# EAGLE schematic BEP32_6stencil_Seed_wMilling (EAGLE 6.4), part 1 of 4

## Sheet 1 of 12
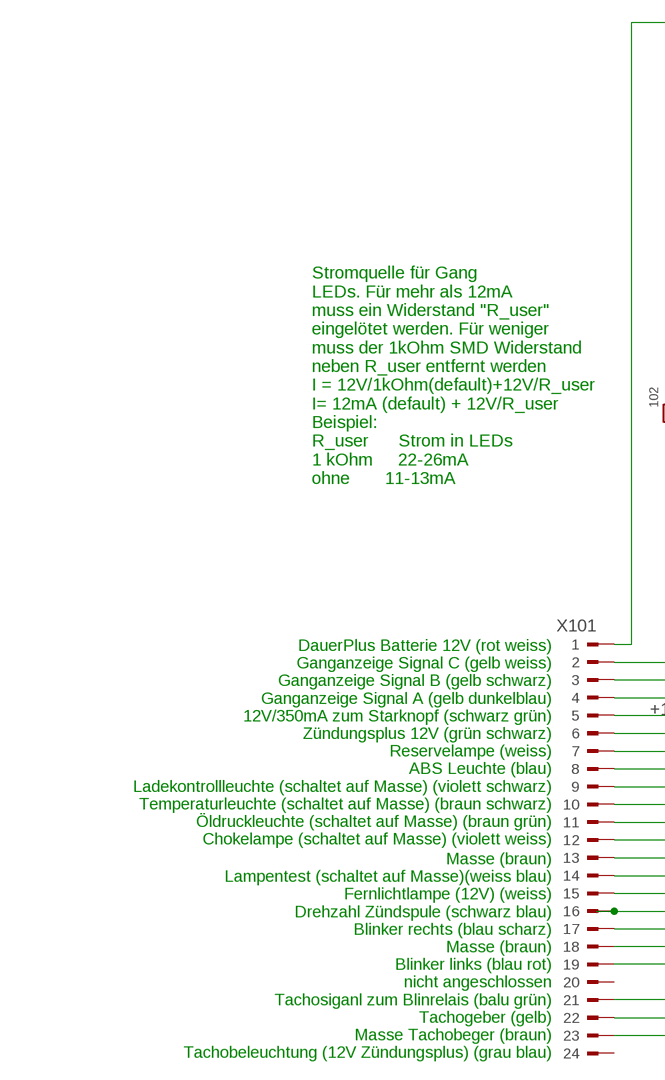
[diagram p0: schematic, sheet 1, part 1 of 2]
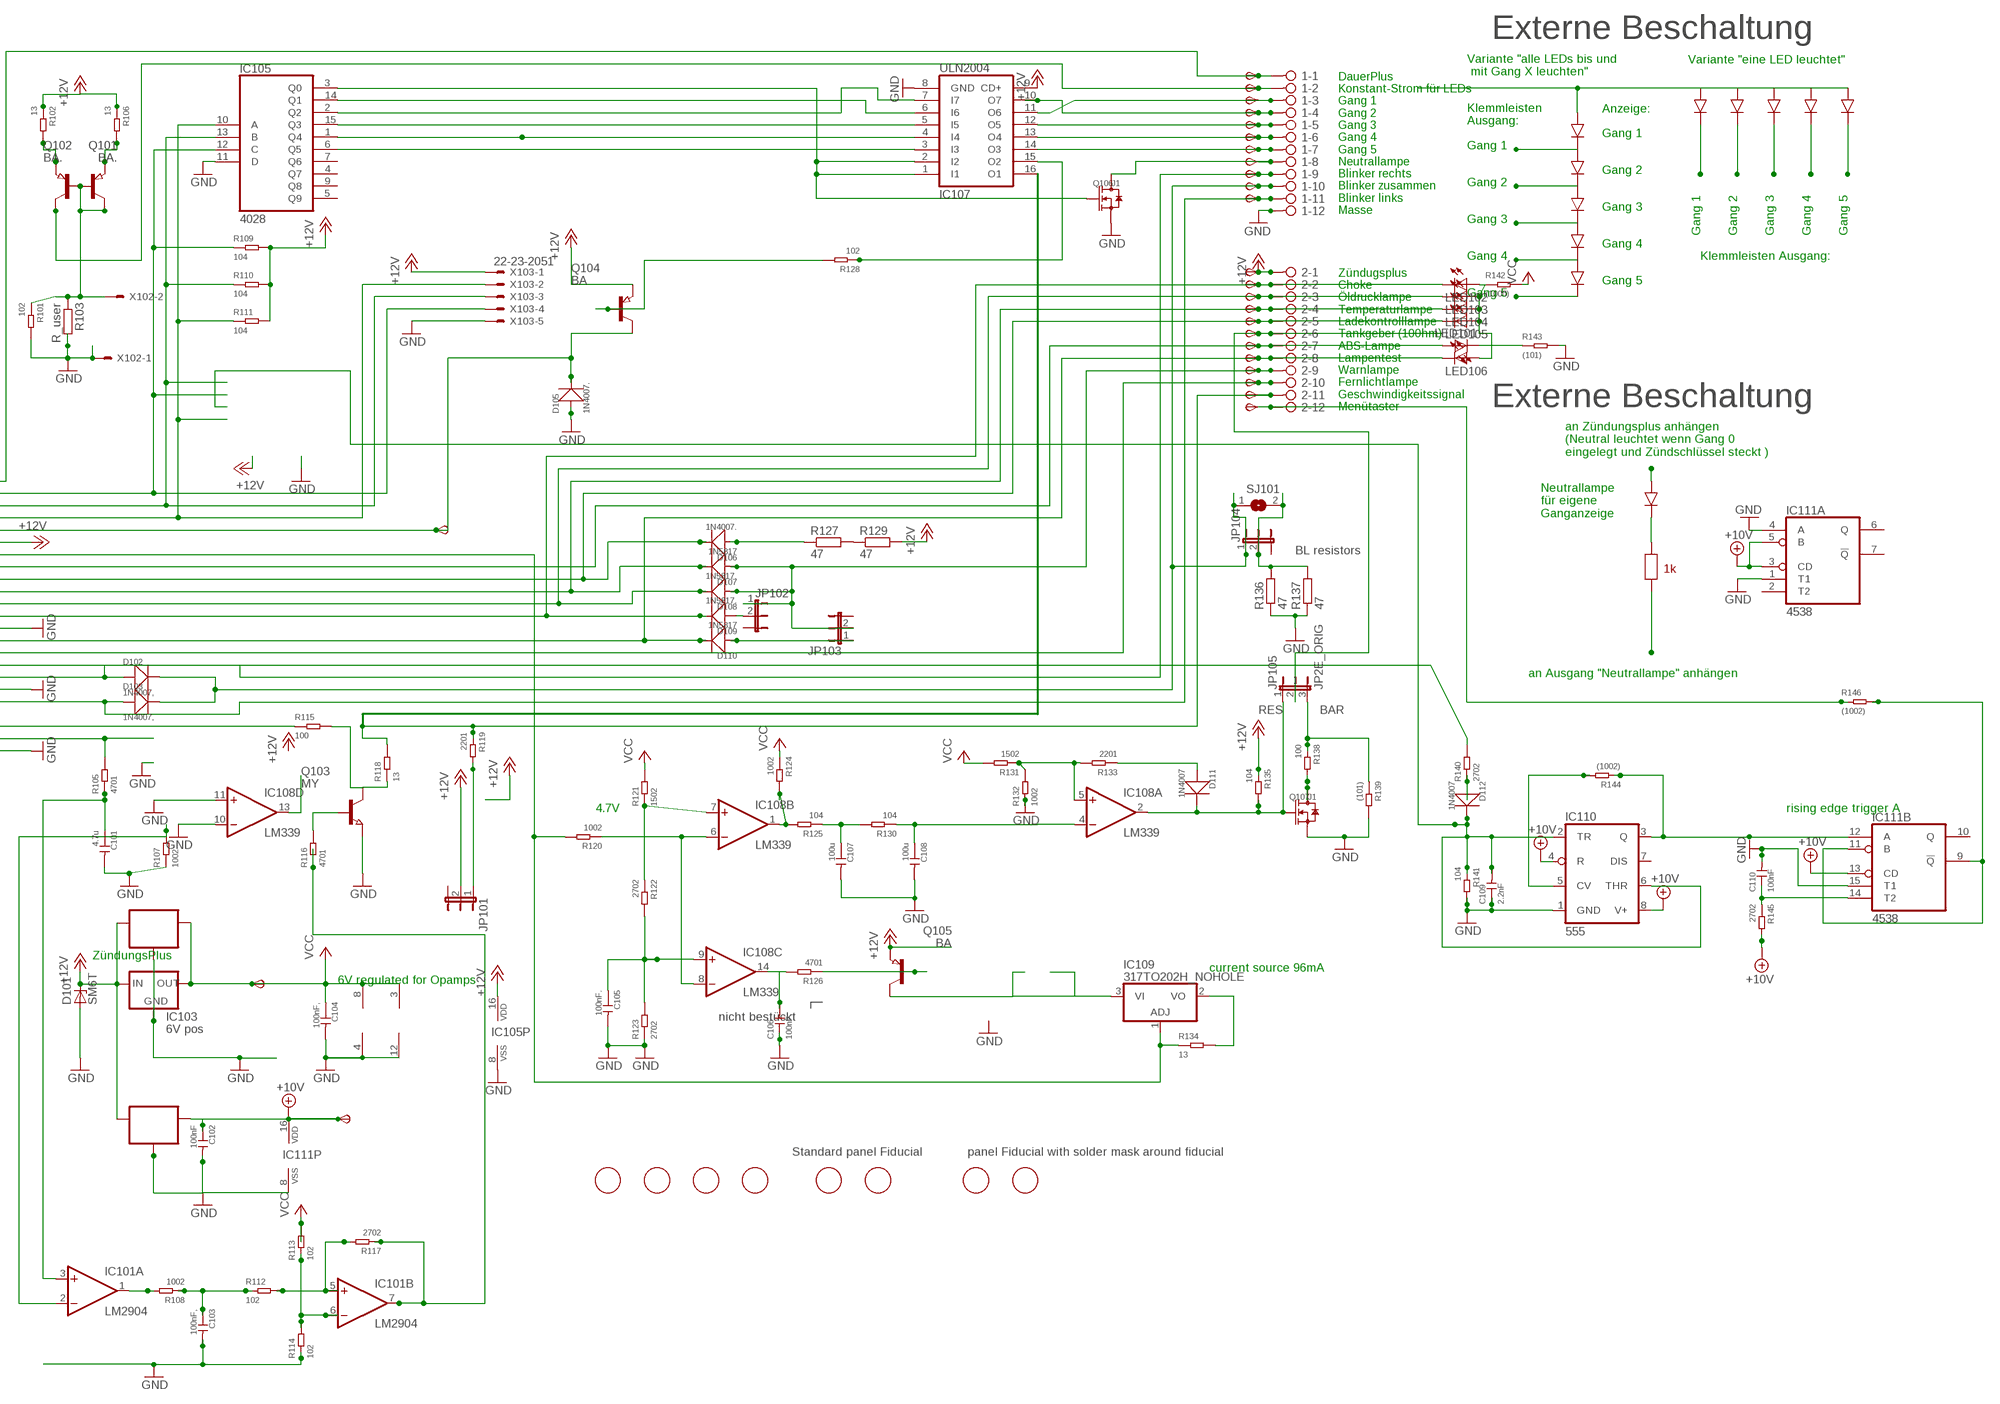
[diagram p1: schematic, sheet 1, part 2 of 2]

### Parts
1  2081-1132  [12-PIN]
2  2081-1132  [12-PIN]
6V  TPSB2.0  [B2.0]
10V  TPSB2.0  [B2.0]
C101  4.7u  CERAMIC-4.7UF-25V-10%-X5R(0805)  [C0805]
C102  100nF  CERAMIC-100NF-50V-10%-X7R(0805)  [C0805]
C103  100nF,  CERAMIC-100NF-50V-10%-X7R(0805)  [C0805]
C104  100nF,  CERAMIC-100NF-50V-10%-X7R(0805)  [C0805]
C105  100nF.  CERAMIC-100NF-50V-10%-X7R(0805)  [C0805]
C106  100nF.  CERAMIC-100NF-50V-10%-X7R(0805)  [C0805]
C107  100u  CERAMIC-100UF-6.3V-20%-X5R(1206)  [C1206]
C108  100u  CERAMIC-100UF-6.3V-20%-X5R(1206)  [C1206]
C109  2.2nF  CERAMIC-100NF-50V-10%-X7R(0805)  [C0805]
C110  100nF  CERAMIC-100NF-50V-10%-X7R(0805)  [C0805]
D101  SM6T  [DO214AA]
D102  1N4007,  DIODE-GEN-PURPOSE-1KV-1A(DO-214AC)  [DO-214AC]
D103  1N4007,  DIODE-GEN-PURPOSE-1KV-1A(DO-214AC)  [DO-214AC]
D105  1N4007.  DIODE-GEN-PURPOSE-1KV-1A(DO-214AC)  [DO-214AC]
D106  1N4007.  DIODE-GEN-PURPOSE-1KV-1A(DO-214AC)  [DO-214AC]
D107  1N5817  DIODE-GEN-PURPOSE-1KV-1A(DO-214AC)DO-214AC/1206  [DO-214AC_SLIM]
D108  1N5817.  DIODE-GEN-PURPOSE-1KV-1A(DO-214AC)DO-214AC/1206  [DO-214AC_SLIM]
D109  1N5817.  DIODE-GEN-PURPOSE-1KV-1A(DO-214AC)DO-214AC/1206  [DO-214AC_SLIM]
D110  1N5817  DIODE-GEN-PURPOSE-1KV-1A(DO-214AC)DO-214AC/1206  [DO-214AC_SLIM]
D111  1N4007  DIODE-GEN-PURPOSE-1KV-1A(DO-214AC)  [DO-214AC]
D112  1N4007  DIODE-GEN-PURPOSE-1KV-1A(DO-214AC)  [DO-214AC]
FID1  FIDUCIAL  [FIDUCIAL_1MM]
FID1B  FIDUCIALFIDUCIAL_1MM_WITH_SOLDERMASK  [FIDUCIAL_1MM_WITH_SOLDERMASK]
FID2  FIDUCIAL  [FIDUCIAL_1MM]
FID2B  FIDUCIALFIDUCIAL_1MM_WITH_SOLDERMASK  [FIDUCIAL_1MM_WITH_SOLDERMASK]
FID101  FIDUCIAL  [FIDUCIAL_1MM]
FID102  FIDUCIAL  [FIDUCIAL_1MM]
FID103  FIDUCIAL  [FIDUCIAL_1MM]
FID104  FIDUCIAL  [FIDUCIAL_1MM]
IC101  LM2904  LM358D  [SO08]
IC102  78L06  78LXXSOT89_ROUND  [SOT89_ROUND]
IC103  6V pos  78LXX  [78LXX]
IC104  78L10  78LXXSOT89_ROUND  [SOT89_ROUND]
IC105  4028  4028D  [SO16]
IC107  ULN2004  ULN2004AD  [SO16]
IC108  LM339  LM339D  [SO14]
IC109  317TO202H_NOHOLE  [TO220H_NOHOLE]
IC110  555  NE555D  [SO08]
IC111  4538  4538D  [SO16]
JP101  JP2EJP2_SMALLPADS  [JP2_SMALLPADS]
JP102  JP2EJP2_SMALLPADS  [JP2_SMALLPADS]
JP103  JP2EJP2_SMALLPADS  [JP2_SMALLPADS]
JP104  JP2EJP2_SMALLPADS  [JP2_SMALLPADS]
JP105  JP2E_ORIG  [JP2_ORIG_SMALLPADS]
LED101  LEDLD260  [LD260]
LED102  LEDLD260  [LD260]
LED103  LEDLD260  [LD260]
LED104  LEDLD260  [LD260]
LED105  LEDLD260  [LD260]
LED106  LEDLD260  [LD260]
Q101  BA.  PNP-TRANSISTOR_SOT89  [SOT89]
Q102  BA.  PNP-TRANSISTOR_SOT89  [SOT89]
Q103  MY  NPN-TRANSISTOR_SOT89  [SOT89]
Q104  BA  PNP-TRANSISTOR_SOT89  [SOT89]
Q105  BA  PNP-TRANSISTOR_SOT89  [SOT89]
Q106  J1  SMD-MOSFET-N-CH-50V-200MA-BSS138W-7-F(SOT-23)  [SOT-23]
Q107  J1  SMD-MOSFET-N-CH-50V-200MA-BSS138W-7-F(SOT-23)  [SOT-23]
R101  102  SMD-RES-1K-5%-1/8W(0805)  [R0805]
R102  13  SMD-RES-13R-5%-1/4W(1206)  [R1206]
R103  R_user  R-EU_R0805  [R0805]
R105  4701  SMD-RES-4.7K-5%-1/8W(0805)  [R0805]
R106  13  SMD-RES-13R-5%-1/4W(1206)  [R1206]
R107  1002  SMD-RES-10K-1%-1/8W(0805)  [R0805]
R108  1002  SMD-RES-10K-1%-1/8W(0805)  [R0805]
R109  104  SMD-RES-10K-1%-1/8W(0805)  [R0805]
R110  104  SMD-RES-10K-1%-1/8W(0805)  [R0805]
R111  104  SMD-RES-10K-1%-1/8W(0805)  [R0805]
R112  102  SMD-RES-1K-5%-1/8W(0805)  [R0805]
R113  102  SMD-RES-1K-5%-1/8W(0805)  [R0805]
R114  102  SMD-RES-1K-5%-1/8W(0805)  [R0805]
R115  100  SMD-RES-220R-5%-1/8W(0805)  [R0805]
R116  4701  SMD-RES-4.7K-5%-1/8W(0805)  [R0805]
R117  2702  SMD-RES-4.7K-5%-1/8W(0805)  [R0805]
R118  13  SMD-RES-13R-5%-1/4W(1206)  [R1206]
R119  2201  SMD-RES-2.2K-5%-1/8W(0805)  [R0805]
R120  1002  SMD-RES-10K-1%-1/8W(0805)  [R0805]
R121  1502  SMD-RES-10K-1%-1/8W(0805)  [R0805]
R122  2702  SMD-RES-4.7K-5%-1/8W(0805)  [R0805]
R123  2702  SMD-RES-4.7K-5%-1/8W(0805)  [R0805]
R124  1002  SMD-RES-10K-1%-1/8W(0805)  [R0805]
R125  104  SMD-RES-10K-1%-1/8W(0805)  [R0805]
R126  4701  SMD-RES-4.7K-5%-1/8W(0805)  [R0805]
R127  47  R-EU_V235/17_1MM  [V235/17_1MM]
R128  102  SMD-RES-1K-5%-1/8W(0805)  [R0805]
R129  47  R-EU_V235/17_1MM  [V235/17_1MM]
R130  104  SMD-RES-10K-1%-1/8W(0805)  [R0805]
R131  1502  SMD-RES-10K-1%-1/8W(0805)  [R0805]
R132  1002  SMD-RES-10K-1%-1/8W(0805)  [R0805]
R133  2201  SMD-RES-2.2K-5%-1/8W(0805)  [R0805]
R134  13  SMD-RES-13R-5%-1/4W(1206)  [R1206]
R135  104  SMD-RES-10K-1%-1/8W(0805)  [R0805]
R136  47  R-EU_V235/17_1MM  [V235/17_1MM]
R137  47  R-EU_V235/17_1MM  [V235/17_1MM]
R138  100  SMD-RES-2.2K-5%-1/8W(0805)  [R0805]
R139  (101)  SMD-RES-2.2K-5%-1/8W(0805)  [R0805]
R140  2702  SMD-RES-10K-1%-1/8W(0805)  [R0805]
R141  104  SMD-RES-10K-1%-1/8W(0805)  [R0805]
R142  (1000)  SMD-RES-100R-5%-1/8W(0805)  [R0805]
R143  (101)  SMD-RES-100R-5%-1/8W(0805)  [R0805]
R144  (1002)  SMD-RES-10K-1%-1/8W(0805)  [R0805]
R145  2702  SMD-RES-4.7K-5%-1/8W(0805)  [R0805]
R146  (1002)  SMD-RES-4.7K-5%-1/8W(0805)  [R0805]
SJ101  SJ  [SJ]
START  TPSB2.0  [B2.0]
TP1  TPSB2.0  [B2.0]
TP2  TPSB2.0  [B2.0]
TP3  TPSB2.0  [B2.0]
TP4  TPSB2.0  [B2.0]
TP5  TPSB2.0  [B2.0]
TP6  TPSB2.0  [B2.0]
TP7  TPSB2.0  [B2.0]
TP8  TPSB2.0  [B2.0]
TP9  TPSB2.0  [B2.0]
TP10  TPSB2.0  [B2.0]
TP11  TPSB2.0  [B2.0]
TP12  TPSB2.0  [B2.0]
TP13  TPSB2.0  [B2.0]
TP16  TPSB2.0  [B2.0]
TP17  TPSB2.0  [B2.0]
TP18  TPSB2.0  [B2.0]
TP19  TPSB2.0  [B2.0]
TP21  TPSB2.0  [B2.0]
TP22  TPSB2.0  [B2.0]
TP23  TPSB2.0  [B2.0]
TP24  TPSB1,27  [B1,27]
TP25  TPSB2.0  [B2.0]
TP26  TPSB2.0  [B2.0]
X101  CON_BMWV2  [24-PIN_V2]
X102  22-23-2021  [22-23-2021]
X103  22-23-2051  [22-23-2051]

### Nets
+10V: 10V.TP(PP) C102.1 IC104.1(OUT) IC110.4(R) IC110.8(V+) IC111.3(A:CD) IC111.5(A:B) IC111.13(B:CD) IC111.16(P:VDD) R145.2 ; also sheet 2,3,4,5,6,7,8,9,10,11,12
+12V: 2.1 D101.C IC102.3(IN) IC103.IN IC104.3(IN) IC105.16(VDD) IC107.9(CD+) JP101.2 Q104.3(E) Q105.3(E) R102.1 R106.1 R109.2 R110.2 R111.2 R129.2 R135.1 TP12.TP(PP) X101.6 X103.1 ; also sheet 2,3,4,5,6,7,8,9,10,11,12
+12V1: IC101.7(B:OUT) R116.1 R117.1
GND: 1.12 C101.2 C102.2 C103.2 C104.2 C105.2 C106.1 C107.2 C108.2 C109.1 C110.2 D101.A D105.1(+) IC101.4(P:V-) IC102.2(GND) IC102.2@1(GND) IC103.GND IC104.2(GND) IC104.2@1(GND) IC105.8(VSS) IC105.11(D) IC107.8(GND) IC108.10(D:-IN) IC108.11(D:+IN) IC108.12(P:GND) IC110.1(GND) IC111.1(A:T1) IC111.4(A:A) IC111.8(P:VSS) IC111.15(B:T1) Q103.3(E) Q106.2(S) Q107.2(S) R101.2 R103.2 R107.1 R114.1 R123.1 R132.1 R136.1 R137.1 R139.2 R141.2 R143.2 X101.13 X101.18 X101.23 X102.1 X103.5 ; also sheet 2,3,4,5,6,7,8,9,10,11,12
N$1: 2.9 D107.1(+) D108.1(+) JP102.1 JP103.2 TP24.TP(PP)
N$2: IC105.10(A) R111.1 X101.4 X103.2
N$3: IC105.13(B) R110.1 X101.3 X103.3
N$4: 2.7 LED101.A TP22.TP(PP) X101.8
N$5: Q101.3(E) R102.2
N$6: D111.2(-) IC108.2(A:OUT) JP105.1 Q107.1(G) R135.2
N$7: IC101.2(A:-IN) R107.2
N$8: R127.2 R129.1
N$9: Q102.3(E) R106.2
N$11: D105.2(-) Q104.2(C) START.TP(PP) X101.5
N$12: 2.2 D109.2(-) LED102.K(C) TP16.TP(PP) X101.12
N$13: 2.3 D108.2(-) LED103.K(C) TP17.TP(PP) X101.11
N$14: 2.4 D107.2(-) LED104.K(C) TP18.TP(PP) X101.10
N$15: IC109.3(VI) Q105.2(C)
N$16: IC108.6(B:-IN) IC108.8(C:-IN) R120.1
N$17: IC105.12(C) R109.1 X101.2 X103.4
N$18: IC105.15(Q3) IC107.5(I5)
N$19: 2.8 D110.2(-) LED106.K(C) TP23.TP(PP) X101.14
N$20: 1.9 D102.1(+) TP9.TP(PP) X101.17
N$21: 1.11 D103.1(+) TP11.TP(PP) X101.19
N$22: IC111.9(B:!Q) IC111.11(B:B) R146.2
N$23: R105.2 X101.22
N$24: C101.1 IC101.3(A:+IN) R105.1
N$25: 1.6 IC107.13(O4) TP6.TP(PP)
N$26: 1.7 IC107.14(O3) TP7.TP(PP)
N$27: 2.11 IC107.16(O1) R118.2 R119.1 TP26.TP(PP)
N$28: 2.6 JP105.2 TP21.TP(PP)
N$29: JP101.1 R119.2
N$30: C105.1 IC108.9(C:+IN) R122.2 R123.2
N$31: C106.2 IC108.14(C:OUT) R126.2
N$32: C109.2 D112.2(-) IC110.2(TR) IC110.6(THR) R141.1
N$34: LED101.K(C) R143.1
N$35: IC109.1(ADJ) R120.2 R134.1 X101.7
N$36: Q105.1(B) R126.1
N$37: IC105.2(Q2) IC107.7(I7)
N$38: 1.3 IC107.11(O6) TP3.TP(PP)
N$39: 1.5 IC107.12(O5) TP5.TP(PP)
N$41: LED102.A LED103.A LED104.A LED105.A LED106.A R142.1
N$42: R140.2 X101.16
N$43: Q104.1(B) R128.2
N$44: IC105.3(Q0) IC107.1(I1) IC107.2(I2) Q106.1(G)
N$45: C107.1 R125.1 R130.2
N$46: C108.1 IC108.4(A:-IN) R130.1
N$47: IC108.5(A:+IN) R131.1 R132.2 R133.2
N$48: Q107.3(D) R138.2
N$49: D111.1(+) R133.1
N$50: IC105.1(Q4) IC107.4(I4)
N$51: R115.1 X101.21
N$52: 1.8 Q106.3(D) TP8.TP(PP)
N$53: 2.10 TP25.TP(PP) X101.15
N$54: D106.1(+) R127.1
N$55: 2.5 D106.2(-) LED105.K(C) TP19.TP(PP) X101.9
N$56: IC105.14(Q1) IC107.6(I6)
N$57: Q101.1(B) Q102.1(B) Q102.2(C) R101.1 R103.1 X102.2
N$58: Q103.2(C) R115.2 R118.1
N$59: 1.2 Q101.2(C) TP2.TP(PP)
N$60: IC108.13(D:OUT)
N$61: IC105.6(Q5) IC107.3(I3)
N$64: IC109.2(VO) R134.2
N$65: IC110.5(CV) R144.2
N$67: 1.4 IC107.10(O7) TP4.TP(PP)
N$69: 1.1 TP1.TP(PP) X101.1
N$83: IC108.7(B:+IN) R121.1 R122.1
N$85: Q103.1(B) R116.2
N$86: IC110.3(Q) IC111.12(B:A) R144.1
N$87: D112.1(+) R140.1
N$88: IC107.15(O2) R128.1
N$89: C110.1 IC111.14(B:T2) R145.1
N$90: 2.12 R146.1 TP13.TP(PP)
N$92: IC101.1(A:OUT) R108.2
N$93: 1.10 D102.2(-) D103.2(-) JP104.1 SJ101.1 TP10.TP(PP)
N$94: JP104.2 R136.2 R137.2 SJ101.2
N$95: D109.1(+) JP102.2
N$96: C103.1 R108.1 R112.1
N$97: IC101.5(B:+IN) R112.2 R117.2
N$98: D110.1(+) JP103.1
N$99: JP105.3 R138.1 R139.1
N$101: IC101.6(B:-IN) R113.1 R114.2
N$580: IC108.1(B:OUT) R124.2 R125.2
VCC: 6V.TP(PP) C104.1 IC101.8(P:V+) IC102.1(OUT) IC103.OUT IC108.3(P:V+) R113.2 R121.2 R124.1 R131.2 R142.2 ; also sheet 2,3,4,5,6,7,8,9,10,11,12
Unconnected: IC105.4(Q7) IC105.5(Q9) IC105.7(Q6) IC105.9(Q8) IC110.7(DIS) IC111.2(A:T2) IC111.6(A:Q) IC111.7(A:!Q) IC111.10(B:Q) X101.20 X101.24

### Notes on the sheet
- Externe Beschaltung
- Variante "eine LED leuchtet"
- Variante "alle LEDs bis und
   mit Gang X leuchten"
- Anzeige:
- Klemmleisten
  Ausgang:
- Gang 1
- DauerPlus
  Konstant-Strom für LEDs
  Gang 1
  Gang 2
  Gang 3
  Gang 4
  Gang 5
  Neutrallampe
  Blinker rechts
  Blinker zusammen
  Blinker links
  Masse
- Gang 1
- Gang 2
- Gang 2
- Gang 3
- Gang 3
- Gang 1 | Gang 2 | Gang 3 | Gang 4 | Gang 5
- Gang 4
- Gang 4 | Klemmleisten Ausgang:
- Gang 5
- Gang 5
- Zündugsplus
  Choke
  Öldrucklampe
  Temperaturlampe
  Ladekontrolllampe
  Tankgeber (100hm)
  ABS-Lampe
  Lampentest
  Warnlampe
  Fernlichtlampe
  Geschwindigkeitssignal
  Menütaster
- Stromquelle für Gang
  LEDs. Für mehr als 12mA
  muss ein Widerstand "R_user"
  eingelötet werden. Für weniger
  muss der 1kOhm SMD Widerstand
  neben R_user entfernt werden
  I = 12V/1kOhm(default)+12V/R_user
  I= 12mA (default) + 12V/R_user
  Beispiel:
  R_user      Strom in LEDs
  1 kOhm     22-26mA
  ohne       11-13mA
- Externe Beschaltung
- an Zündungsplus anhängen
  (Neutral leuchtet wenn Gang 0
  eingelegt und Zündschlüssel steckt )
- Neutrallampe
  für eigene
  Ganganzeige
- DauerPlus Batterie 12V (rot weiss)
  Ganganzeige Signal C (gelb weiss)
  Ganganzeige Signal B (gelb schwarz)
  Ganganzeige Signal A (gelb dunkelblau)
  12V/350mA zum Starknopf (schwarz grün)
  Zündungsplus 12V (grün schwarz)
  Reservelampe (weiss)
  ABS Leuchte (blau)
  Ladekontrollleuchte (schaltet auf Masse) (violett schwarz)
  Temperaturleuchte (schaltet auf Masse) (braun schwarz)
  Öldruckleuchte (schaltet auf Masse) (braun grün)
  Chokelampe (schaltet auf Masse) (violett weiss)
- BL resistors
- 1k
- an Ausgang "Neutrallampe" anhängen
- Masse (braun)
  Lampentest (schaltet auf Masse)(weiss blau)
  Fernlichtlampe (12V) (weiss)
  Drehzahl Zündspule (schwarz blau)
  Blinker rechts (blau scharz)
  Masse (braun)
  Blinker links (blau rot)
  nicht angeschlossen
  Tachosiganl zum Blinrelais (balu grün)
  Tachogeber (gelb)
  Masse Tachobeger (braun)
  Tachobeleuchtung (12V Zündungsplus) (grau blau)
- RES | BAR
- 4.7V | rising edge trigger A
- ZündungsPlus
- current source 96mA
- 6V regulated for Opamps
- nicht bestückt
- Standard panel Fiducial | panel Fiducial with solder mask around fiducial

## Sheet 2 of 12
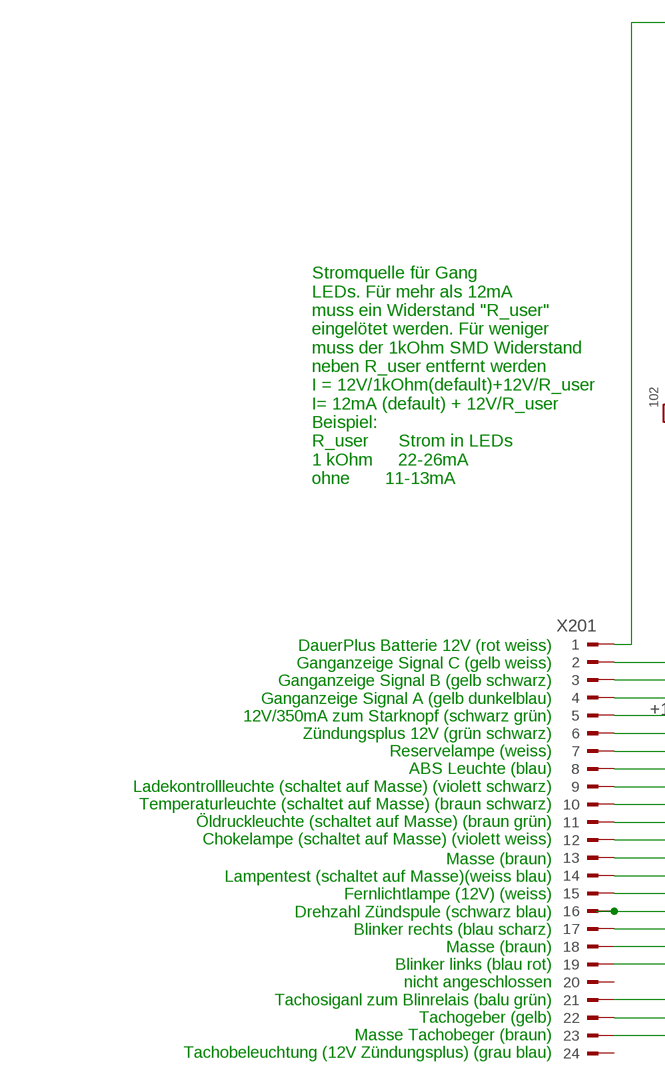
[diagram p2: schematic, sheet 2, part 1 of 2]
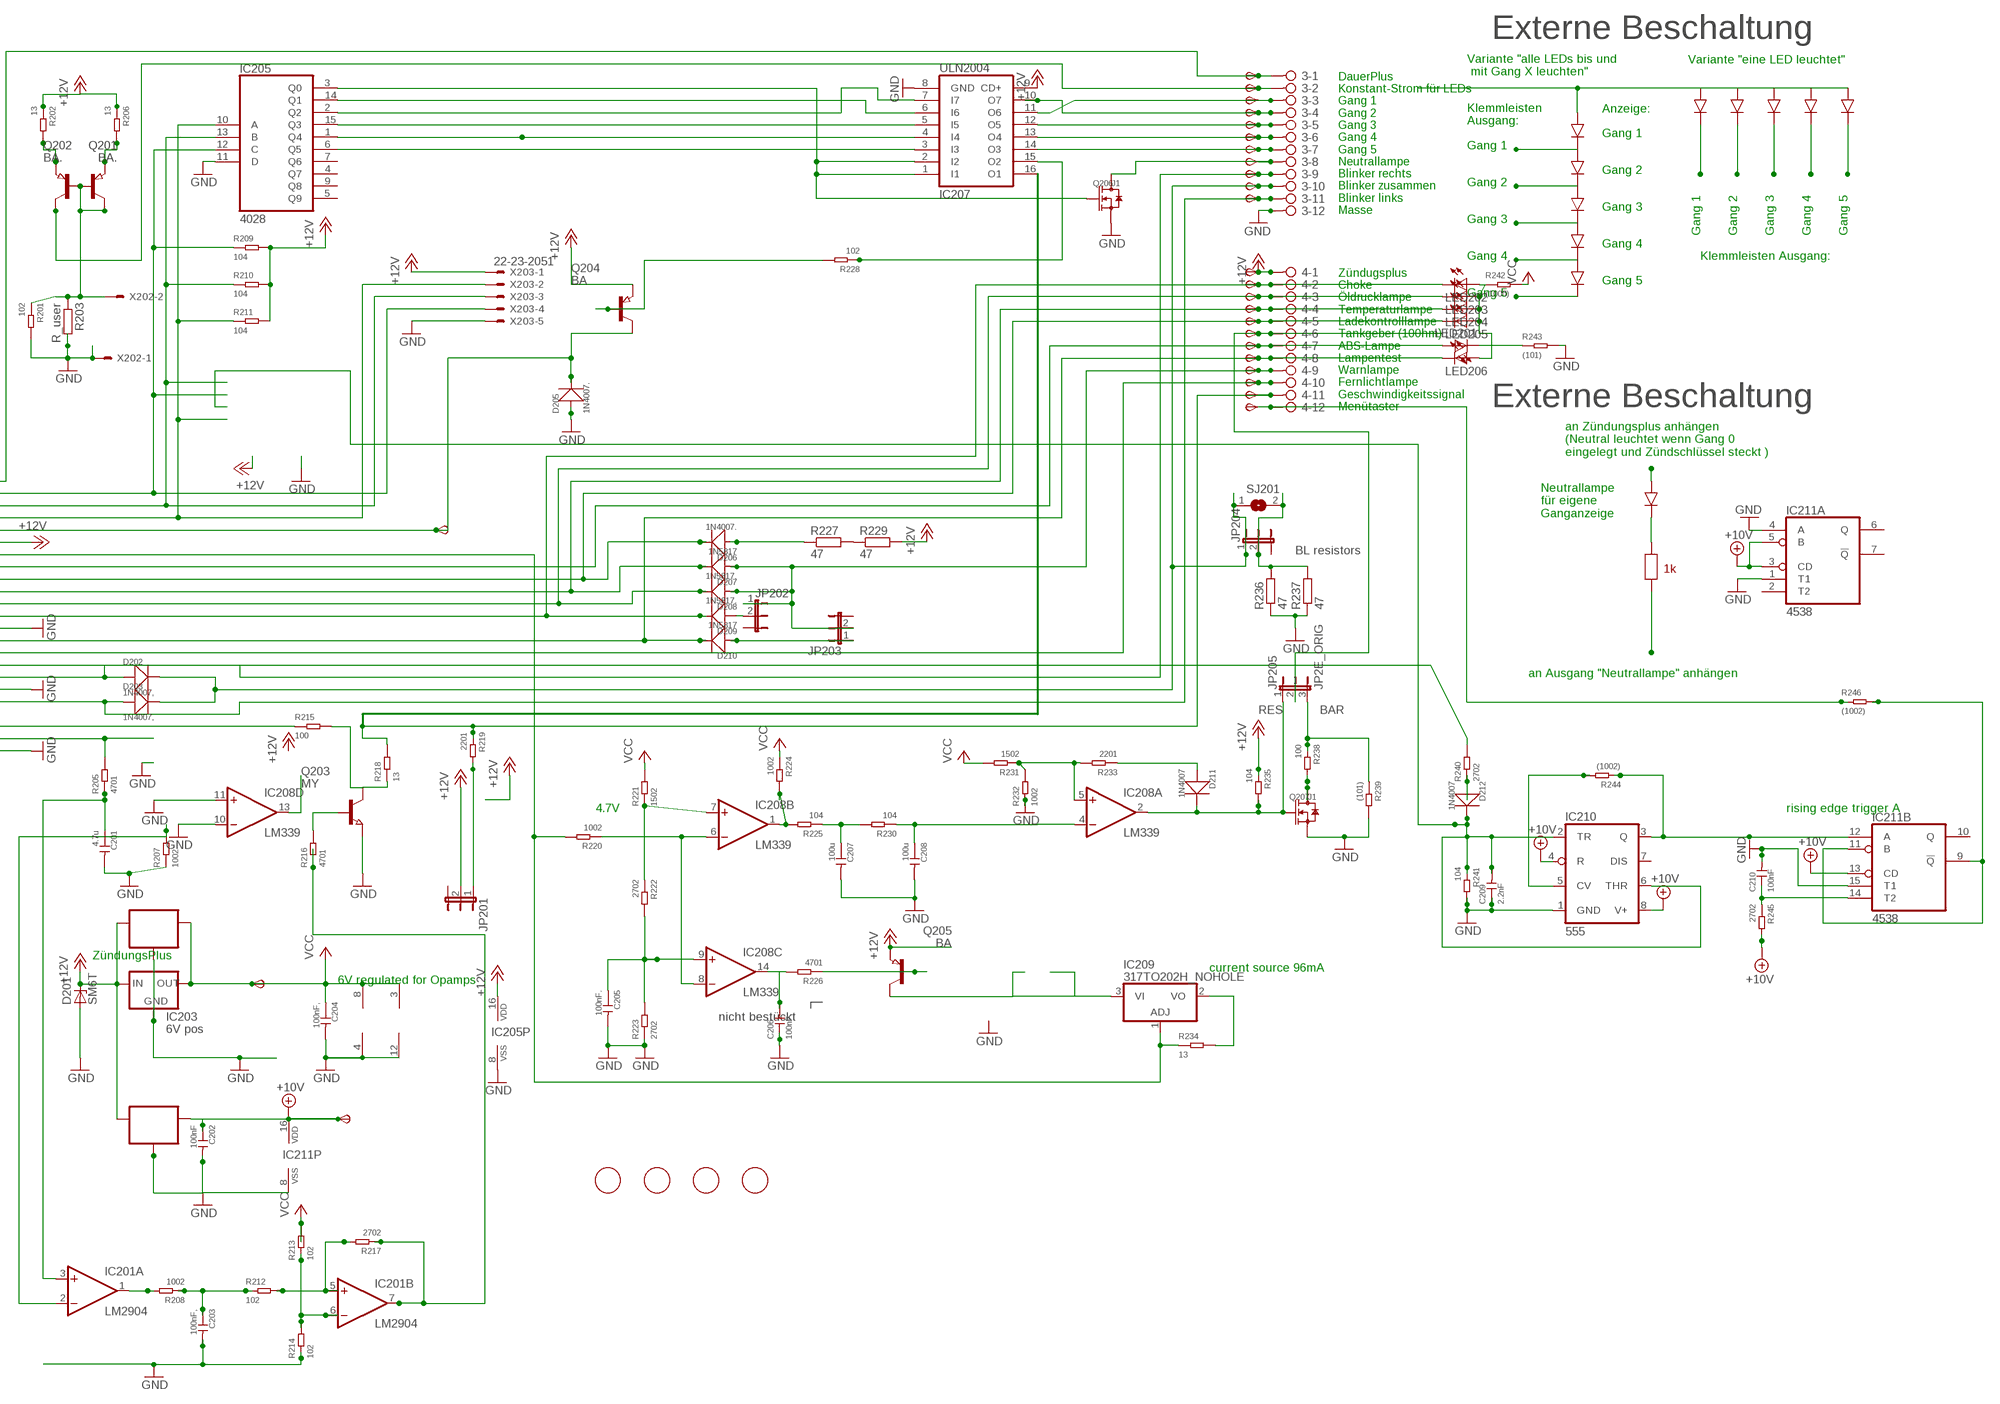
[diagram p3: schematic, sheet 2, part 2 of 2]

### Parts
3  2081-1132  [12-PIN]
4  2081-1132  [12-PIN]
6V201  TPSB2.0  [B2.0]
10V201  TPSB2.0  [B2.0]
C201  4.7u  CERAMIC-4.7UF-25V-10%-X5R(0805)  [C0805]
C202  100nF  CERAMIC-100NF-50V-10%-X7R(0805)  [C0805]
C203  100nF,  CERAMIC-100NF-50V-10%-X7R(0805)  [C0805]
C204  100nF,  CERAMIC-100NF-50V-10%-X7R(0805)  [C0805]
C205  100nF.  CERAMIC-100NF-50V-10%-X7R(0805)  [C0805]
C206  100nF.  CERAMIC-100NF-50V-10%-X7R(0805)  [C0805]
C207  100u  CERAMIC-100UF-6.3V-20%-X5R(1206)  [C1206]
C208  100u  CERAMIC-100UF-6.3V-20%-X5R(1206)  [C1206]
C209  2.2nF  CERAMIC-100NF-50V-10%-X7R(0805)  [C0805]
C210  100nF  CERAMIC-100NF-50V-10%-X7R(0805)  [C0805]
D201  SM6T  [DO214AA]
D202  1N4007,  DIODE-GEN-PURPOSE-1KV-1A(DO-214AC)  [DO-214AC]
D203  1N4007,  DIODE-GEN-PURPOSE-1KV-1A(DO-214AC)  [DO-214AC]
D205  1N4007.  DIODE-GEN-PURPOSE-1KV-1A(DO-214AC)  [DO-214AC]
D206  1N4007.  DIODE-GEN-PURPOSE-1KV-1A(DO-214AC)  [DO-214AC]
D207  1N5817  DIODE-GEN-PURPOSE-1KV-1A(DO-214AC)DO-214AC/1206  [DO-214AC_SLIM]
D208  1N5817.  DIODE-GEN-PURPOSE-1KV-1A(DO-214AC)DO-214AC/1206  [DO-214AC_SLIM]
D209  1N5817.  DIODE-GEN-PURPOSE-1KV-1A(DO-214AC)DO-214AC/1206  [DO-214AC_SLIM]
D210  1N5817  DIODE-GEN-PURPOSE-1KV-1A(DO-214AC)DO-214AC/1206  [DO-214AC_SLIM]
D211  1N4007  DIODE-GEN-PURPOSE-1KV-1A(DO-214AC)  [DO-214AC]
D212  1N4007  DIODE-GEN-PURPOSE-1KV-1A(DO-214AC)  [DO-214AC]
FID201  FIDUCIAL  [FIDUCIAL_1MM]
FID202  FIDUCIAL  [FIDUCIAL_1MM]
FID203  FIDUCIAL  [FIDUCIAL_1MM]
FID204  FIDUCIAL  [FIDUCIAL_1MM]
IC201  LM2904  LM358D  [SO08]
IC202  78L06  78LXXSOT89_ROUND  [SOT89_ROUND]
IC203  6V pos  78LXX  [78LXX]
IC204  78L10  78LXXSOT89_ROUND  [SOT89_ROUND]
IC205  4028  4028D  [SO16]
IC207  ULN2004  ULN2004AD  [SO16]
IC208  LM339  LM339D  [SO14]
IC209  317TO202H_NOHOLE  [TO220H_NOHOLE]
IC210  555  NE555D  [SO08]
IC211  4538  4538D  [SO16]
JP201  JP2EJP2_SMALLPADS  [JP2_SMALLPADS]
JP202  JP2EJP2_SMALLPADS  [JP2_SMALLPADS]
JP203  JP2EJP2_SMALLPADS  [JP2_SMALLPADS]
JP204  JP2EJP2_SMALLPADS  [JP2_SMALLPADS]
JP205  JP2E_ORIG  [JP2_ORIG_SMALLPADS]
LED201  LEDLD260  [LD260]
LED202  LEDLD260  [LD260]
LED203  LEDLD260  [LD260]
LED204  LEDLD260  [LD260]
LED205  LEDLD260  [LD260]
LED206  LEDLD260  [LD260]
Q201  BA.  PNP-TRANSISTOR_SOT89  [SOT89]
Q202  BA.  PNP-TRANSISTOR_SOT89  [SOT89]
Q203  MY  NPN-TRANSISTOR_SOT89  [SOT89]
Q204  BA  PNP-TRANSISTOR_SOT89  [SOT89]
Q205  BA  PNP-TRANSISTOR_SOT89  [SOT89]
Q206  J1  SMD-MOSFET-N-CH-50V-200MA-BSS138W-7-F(SOT-23)  [SOT-23]
Q207  J1  SMD-MOSFET-N-CH-50V-200MA-BSS138W-7-F(SOT-23)  [SOT-23]
R201  102  SMD-RES-1K-5%-1/8W(0805)  [R0805]
R202  13  SMD-RES-13R-5%-1/4W(1206)  [R1206]
R203  R_user  R-EU_R0805  [R0805]
R205  4701  SMD-RES-4.7K-5%-1/8W(0805)  [R0805]
R206  13  SMD-RES-13R-5%-1/4W(1206)  [R1206]
R207  1002  SMD-RES-10K-1%-1/8W(0805)  [R0805]
R208  1002  SMD-RES-10K-1%-1/8W(0805)  [R0805]
R209  104  SMD-RES-10K-1%-1/8W(0805)  [R0805]
R210  104  SMD-RES-10K-1%-1/8W(0805)  [R0805]
R211  104  SMD-RES-10K-1%-1/8W(0805)  [R0805]
R212  102  SMD-RES-1K-5%-1/8W(0805)  [R0805]
R213  102  SMD-RES-1K-5%-1/8W(0805)  [R0805]
R214  102  SMD-RES-1K-5%-1/8W(0805)  [R0805]
R215  100  SMD-RES-220R-5%-1/8W(0805)  [R0805]
R216  4701  SMD-RES-4.7K-5%-1/8W(0805)  [R0805]
R217  2702  SMD-RES-4.7K-5%-1/8W(0805)  [R0805]
R218  13  SMD-RES-13R-5%-1/4W(1206)  [R1206]
R219  2201  SMD-RES-2.2K-5%-1/8W(0805)  [R0805]
R220  1002  SMD-RES-10K-1%-1/8W(0805)  [R0805]
R221  1502  SMD-RES-10K-1%-1/8W(0805)  [R0805]
R222  2702  SMD-RES-4.7K-5%-1/8W(0805)  [R0805]
R223  2702  SMD-RES-4.7K-5%-1/8W(0805)  [R0805]
R224  1002  SMD-RES-10K-1%-1/8W(0805)  [R0805]
R225  104  SMD-RES-10K-1%-1/8W(0805)  [R0805]
R226  4701  SMD-RES-4.7K-5%-1/8W(0805)  [R0805]
R227  47  R-EU_V235/17_1MM  [V235/17_1MM]
R228  102  SMD-RES-1K-5%-1/8W(0805)  [R0805]
R229  47  R-EU_V235/17_1MM  [V235/17_1MM]
R230  104  SMD-RES-10K-1%-1/8W(0805)  [R0805]
R231  1502  SMD-RES-10K-1%-1/8W(0805)  [R0805]
R232  1002  SMD-RES-10K-1%-1/8W(0805)  [R0805]
R233  2201  SMD-RES-2.2K-5%-1/8W(0805)  [R0805]
R234  13  SMD-RES-13R-5%-1/4W(1206)  [R1206]
R235  104  SMD-RES-10K-1%-1/8W(0805)  [R0805]
R236  47  R-EU_V235/17_1MM  [V235/17_1MM]
R237  47  R-EU_V235/17_1MM  [V235/17_1MM]
R238  100  SMD-RES-2.2K-5%-1/8W(0805)  [R0805]
R239  (101)  SMD-RES-2.2K-5%-1/8W(0805)  [R0805]
R240  2702  SMD-RES-10K-1%-1/8W(0805)  [R0805]
R241  104  SMD-RES-10K-1%-1/8W(0805)  [R0805]
R242  (1000)  SMD-RES-100R-5%-1/8W(0805)  [R0805]
R243  (101)  SMD-RES-100R-5%-1/8W(0805)  [R0805]
R244  (1002)  SMD-RES-10K-1%-1/8W(0805)  [R0805]
R245  2702  SMD-RES-4.7K-5%-1/8W(0805)  [R0805]
R246  (1002)  SMD-RES-4.7K-5%-1/8W(0805)  [R0805]
SJ201  SJ  [SJ]
START201  TPSB2.0  [B2.0]
TP14  TPSB2.0  [B2.0]
TP15  TPSB2.0  [B2.0]
TP20  TPSB2.0  [B2.0]
TP27  TPSB2.0  [B2.0]
TP28  TPSB2.0  [B2.0]
TP29  TPSB2.0  [B2.0]
TP30  TPSB2.0  [B2.0]
TP31  TPSB2.0  [B2.0]
TP32  TPSB2.0  [B2.0]
TP33  TPSB2.0  [B2.0]
TP34  TPSB2.0  [B2.0]
TP35  TPSB2.0  [B2.0]
TP36  TPSB2.0  [B2.0]
TP37  TPSB2.0  [B2.0]
TP38  TPSB2.0  [B2.0]
TP39  TPSB2.0  [B2.0]
TP40  TPSB2.0  [B2.0]
TP41  TPSB2.0  [B2.0]
TP42  TPSB1,27  [B1,27]
TP43  TPSB2.0  [B2.0]
TP44  TPSB2.0  [B2.0]
TP45  TPSB2.0  [B2.0]
TP46  TPSB2.0  [B2.0]
X201  CON_BMWV2  [24-PIN_V2]
X202  22-23-2021  [22-23-2021]
X203  22-23-2051  [22-23-2051]

### Nets
+10V: 10V201.TP(PP) C202.1 IC204.1(OUT) IC210.4(R) IC210.8(V+) IC211.3(A:CD) IC211.5(A:B) IC211.13(B:CD) IC211.16(P:VDD) R245.2 ; also sheet 1,3,4,5,6,7,8,9,10,11,12
+12V: 4.1 D201.C IC202.3(IN) IC203.IN IC204.3(IN) IC205.16(VDD) IC207.9(CD+) JP201.2 Q204.3(E) Q205.3(E) R202.1 R206.1 R209.2 R210.2 R211.2 R229.2 R235.1 TP45.TP(PP) X201.6 X203.1 ; also sheet 1,3,4,5,6,7,8,9,10,11,12
+12V2: IC201.7(B:OUT) R216.1 R217.1
GND: 3.12 C201.2 C202.2 C203.2 C204.2 C205.2 C206.1 C207.2 C208.2 C209.1 C210.2 D201.A D205.1(+) IC201.4(P:V-) IC202.2(GND) IC202.2@1(GND) IC203.GND IC204.2(GND) IC204.2@1(GND) IC205.8(VSS) IC205.11(D) IC207.8(GND) IC208.10(D:-IN) IC208.11(D:+IN) IC208.12(P:GND) IC210.1(GND) IC211.1(A:T1) IC211.4(A:A) IC211.8(P:VSS) IC211.15(B:T1) Q203.3(E) Q206.2(S) Q207.2(S) R201.2 R203.2 R207.1 R214.1 R223.1 R232.1 R236.1 R237.1 R239.2 R241.2 R243.2 X201.13 X201.18 X201.23 X202.1 X203.5 ; also sheet 1,3,4,5,6,7,8,9,10,11,12
N$84: R227.2 R229.1
N$91: 4.9 D207.1(+) D208.1(+) JP202.1 JP203.2 TP42.TP(PP)
N$100: IC205.10(A) R211.1 X201.4 X203.2
N$102: IC205.13(B) R210.1 X201.3 X203.3
N$103: D205.2(-) Q204.2(C) START201.TP(PP) X201.5
N$104: IC205.12(C) R209.1 X201.2 X203.4
N$105: 4.7 LED201.A TP40.TP(PP) X201.8
N$106: 4.2 D209.2(-) LED202.K(C) TP35.TP(PP) X201.12
N$107: 4.3 D208.2(-) LED203.K(C) TP36.TP(PP) X201.11
N$108: 4.4 D207.2(-) LED204.K(C) TP37.TP(PP) X201.10
N$109: 4.8 D210.2(-) LED206.K(C) TP41.TP(PP) X201.14
N$110: 3.9 D202.1(+) TP32.TP(PP) X201.17
N$111: 3.11 D203.1(+) TP34.TP(PP) X201.19
N$112: R205.2 X201.22
N$113: C201.1 IC201.3(A:+IN) R205.1
N$114: 4.11 IC207.16(O1) R218.2 R219.1 TP44.TP(PP)
N$115: IC208.1(B:OUT) R224.2 R225.2
N$116: C207.1 R225.1 R230.2
N$117: C208.1 IC208.4(A:-IN) R230.1
N$118: IC208.5(A:+IN) R231.1 R232.2 R233.2
N$119: D211.1(+) R233.1
N$120: C205.1 IC208.9(C:+IN) R222.2 R223.2
N$121: C206.2 IC208.14(C:OUT) R226.2
N$122: Q205.1(B) R226.1
N$123: IC205.2(Q2) IC207.7(I7)
N$124: 3.5 IC207.12(O5) TP28.TP(PP)
N$125: IC205.1(Q4) IC207.4(I4)
N$126: 3.8 Q206.3(D) TP31.TP(PP)
N$127: 4.10 TP43.TP(PP) X201.15
N$128: 4.5 D206.2(-) LED205.K(C) TP38.TP(PP) X201.9
N$129: D206.1(+) R227.1
N$130: IC205.6(Q5) IC207.3(I3)
N$131: 3.4 IC207.10(O7) TP27.TP(PP)
N$132: IC209.1(ADJ) R220.2 R234.1 X201.7
N$133: IC208.6(B:-IN) IC208.8(C:-IN) R220.1
N$134: 3.2 Q201.2(C) TP15.TP(PP)
N$135: 3.1 TP14.TP(PP) X201.1
N$149: R240.2 X201.16
N$150: IC205.15(Q3) IC207.5(I5)
N$151: 3.6 IC207.13(O4) TP29.TP(PP)
N$152: 3.7 IC207.14(O3) TP30.TP(PP)
N$153: 4.6 JP205.2 TP39.TP(PP)
N$154: LED201.K(C) R243.1
N$155: LED202.A LED203.A LED204.A LED205.A LED206.A R242.1
N$156: Q204.1(B) R228.2
N$157: IC205.3(Q0) IC207.1(I1) IC207.2(I2) Q206.1(G)
N$158: IC205.14(Q1) IC207.6(I6)
N$159: 3.3 IC207.11(O6) TP20.TP(PP)
N$160: Q201.1(B) Q202.1(B) Q202.2(C) R201.1 R203.1 X202.2
N$161: Q201.3(E) R202.2
N$162: Q202.3(E) R206.2
N$163: IC208.7(B:+IN) R221.1 R222.1
N$164: IC201.2(A:-IN) R207.2
N$165: Q203.1(B) R216.2
N$166: Q207.3(D) R238.2
N$167: IC209.2(VO) R234.2
N$168: IC209.3(VI) Q205.2(C)
N$169: C209.2 D212.2(-) IC210.2(TR) IC210.6(THR) R241.1
N$170: IC210.5(CV) R244.2
N$171: IC210.3(Q) IC211.12(B:A) R244.1
N$172: D212.1(+) R240.1
N$173: 3.10 D202.2(-) D203.2(-) JP204.1 SJ201.1 TP33.TP(PP)
N$174: JP204.2 R236.2 R237.2 SJ201.2
N$175: IC211.9(B:!Q) IC211.11(B:B) R246.2
N$176: C210.1 IC211.14(B:T2) R245.1
N$177: JP201.1 R219.2
N$178: IC207.15(O2) R228.1
N$179: 4.12 R246.1 TP46.TP(PP)
N$180: D209.1(+) JP202.2
N$181: D211.2(-) IC208.2(A:OUT) JP205.1 Q207.1(G) R235.2
N$182: IC201.1(A:OUT) R208.2
N$183: C203.1 R208.1 R212.1
N$184: IC201.5(B:+IN) R212.2 R217.2
N$185: IC201.6(B:-IN) R213.1 R214.2
N$186: D210.1(+) JP203.1
N$187: JP205.3 R238.1 R239.1
N$188: IC208.13(D:OUT)
N$189: R215.1 X201.21
N$190: Q203.2(C) R215.2 R218.1
VCC: 6V201.TP(PP) C204.1 IC201.8(P:V+) IC202.1(OUT) IC203.OUT IC208.3(P:V+) R213.2 R221.2 R224.1 R231.2 R242.2 ; also sheet 1,3,4,5,6,7,8,9,10,11,12
Unconnected: IC205.4(Q7) IC205.5(Q9) IC205.7(Q6) IC205.9(Q8) IC210.7(DIS) IC211.2(A:T2) IC211.6(A:Q) IC211.7(A:!Q) IC211.10(B:Q) X201.20 X201.24

### Notes on the sheet
- Externe Beschaltung
- Variante "eine LED leuchtet"
- Variante "alle LEDs bis und
   mit Gang X leuchten"
- Anzeige:
- Klemmleisten
  Ausgang:
- Gang 1
- DauerPlus
  Konstant-Strom für LEDs
  Gang 1
  Gang 2
  Gang 3
  Gang 4
  Gang 5
  Neutrallampe
  Blinker rechts
  Blinker zusammen
  Blinker links
  Masse
- Gang 1
- Gang 2
- Gang 2
- Gang 3
- Gang 3
- Gang 1 | Gang 2 | Gang 3 | Gang 4 | Gang 5
- Gang 4
- Gang 4 | Klemmleisten Ausgang:
- Gang 5
- Gang 5
- Zündugsplus
  Choke
  Öldrucklampe
  Temperaturlampe
  Ladekontrolllampe
  Tankgeber (100hm)
  ABS-Lampe
  Lampentest
  Warnlampe
  Fernlichtlampe
  Geschwindigkeitssignal
  Menütaster
- Stromquelle für Gang
  LEDs. Für mehr als 12mA
  muss ein Widerstand "R_user"
  eingelötet werden. Für weniger
  muss der 1kOhm SMD Widerstand
  neben R_user entfernt werden
  I = 12V/1kOhm(default)+12V/R_user
  I= 12mA (default) + 12V/R_user
  Beispiel:
  R_user      Strom in LEDs
  1 kOhm     22-26mA
  ohne       11-13mA
- Externe Beschaltung
- an Zündungsplus anhängen
  (Neutral leuchtet wenn Gang 0
  eingelegt und Zündschlüssel steckt )
- Neutrallampe
  für eigene
  Ganganzeige
- DauerPlus Batterie 12V (rot weiss)
  Ganganzeige Signal C (gelb weiss)
  Ganganzeige Signal B (gelb schwarz)
  Ganganzeige Signal A (gelb dunkelblau)
  12V/350mA zum Starknopf (schwarz grün)
  Zündungsplus 12V (grün schwarz)
  Reservelampe (weiss)
  ABS Leuchte (blau)
  Ladekontrollleuchte (schaltet auf Masse) (violett schwarz)
  Temperaturleuchte (schaltet auf Masse) (braun schwarz)
  Öldruckleuchte (schaltet auf Masse) (braun grün)
  Chokelampe (schaltet auf Masse) (violett weiss)
- BL resistors
- 1k
- an Ausgang "Neutrallampe" anhängen
- Masse (braun)
  Lampentest (schaltet auf Masse)(weiss blau)
  Fernlichtlampe (12V) (weiss)
  Drehzahl Zündspule (schwarz blau)
  Blinker rechts (blau scharz)
  Masse (braun)
  Blinker links (blau rot)
  nicht angeschlossen
  Tachosiganl zum Blinrelais (balu grün)
  Tachogeber (gelb)
  Masse Tachobeger (braun)
  Tachobeleuchtung (12V Zündungsplus) (grau blau)
- RES | BAR
- 4.7V | rising edge trigger A
- ZündungsPlus
- current source 96mA
- 6V regulated for Opamps
- nicht bestückt

## Sheet 3 of 12
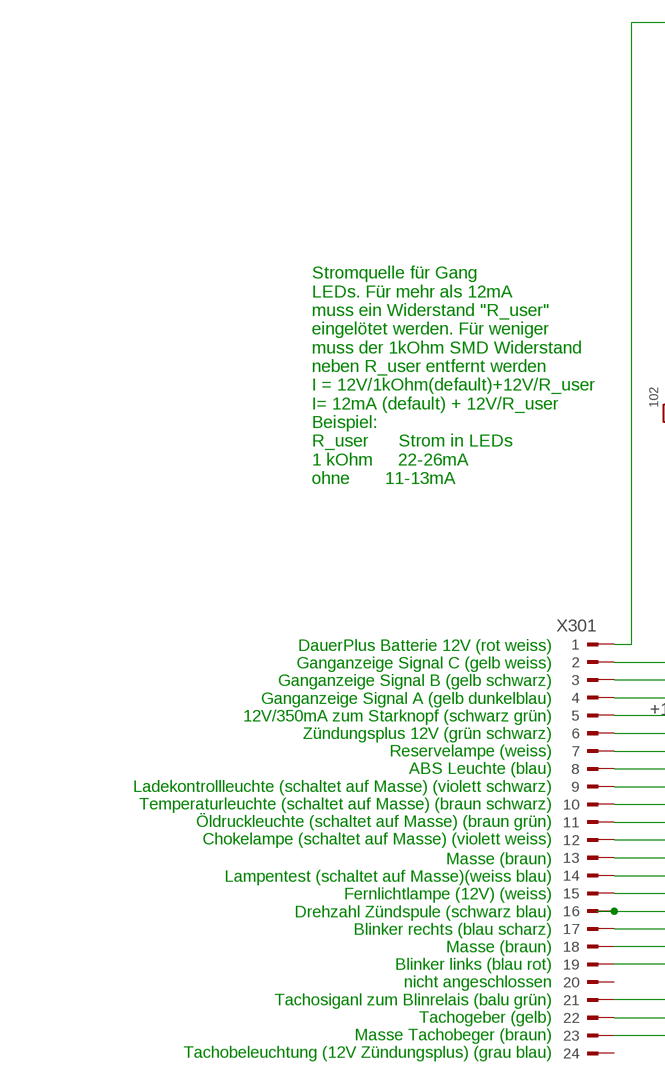
[diagram p4: schematic, sheet 3, part 1 of 2]
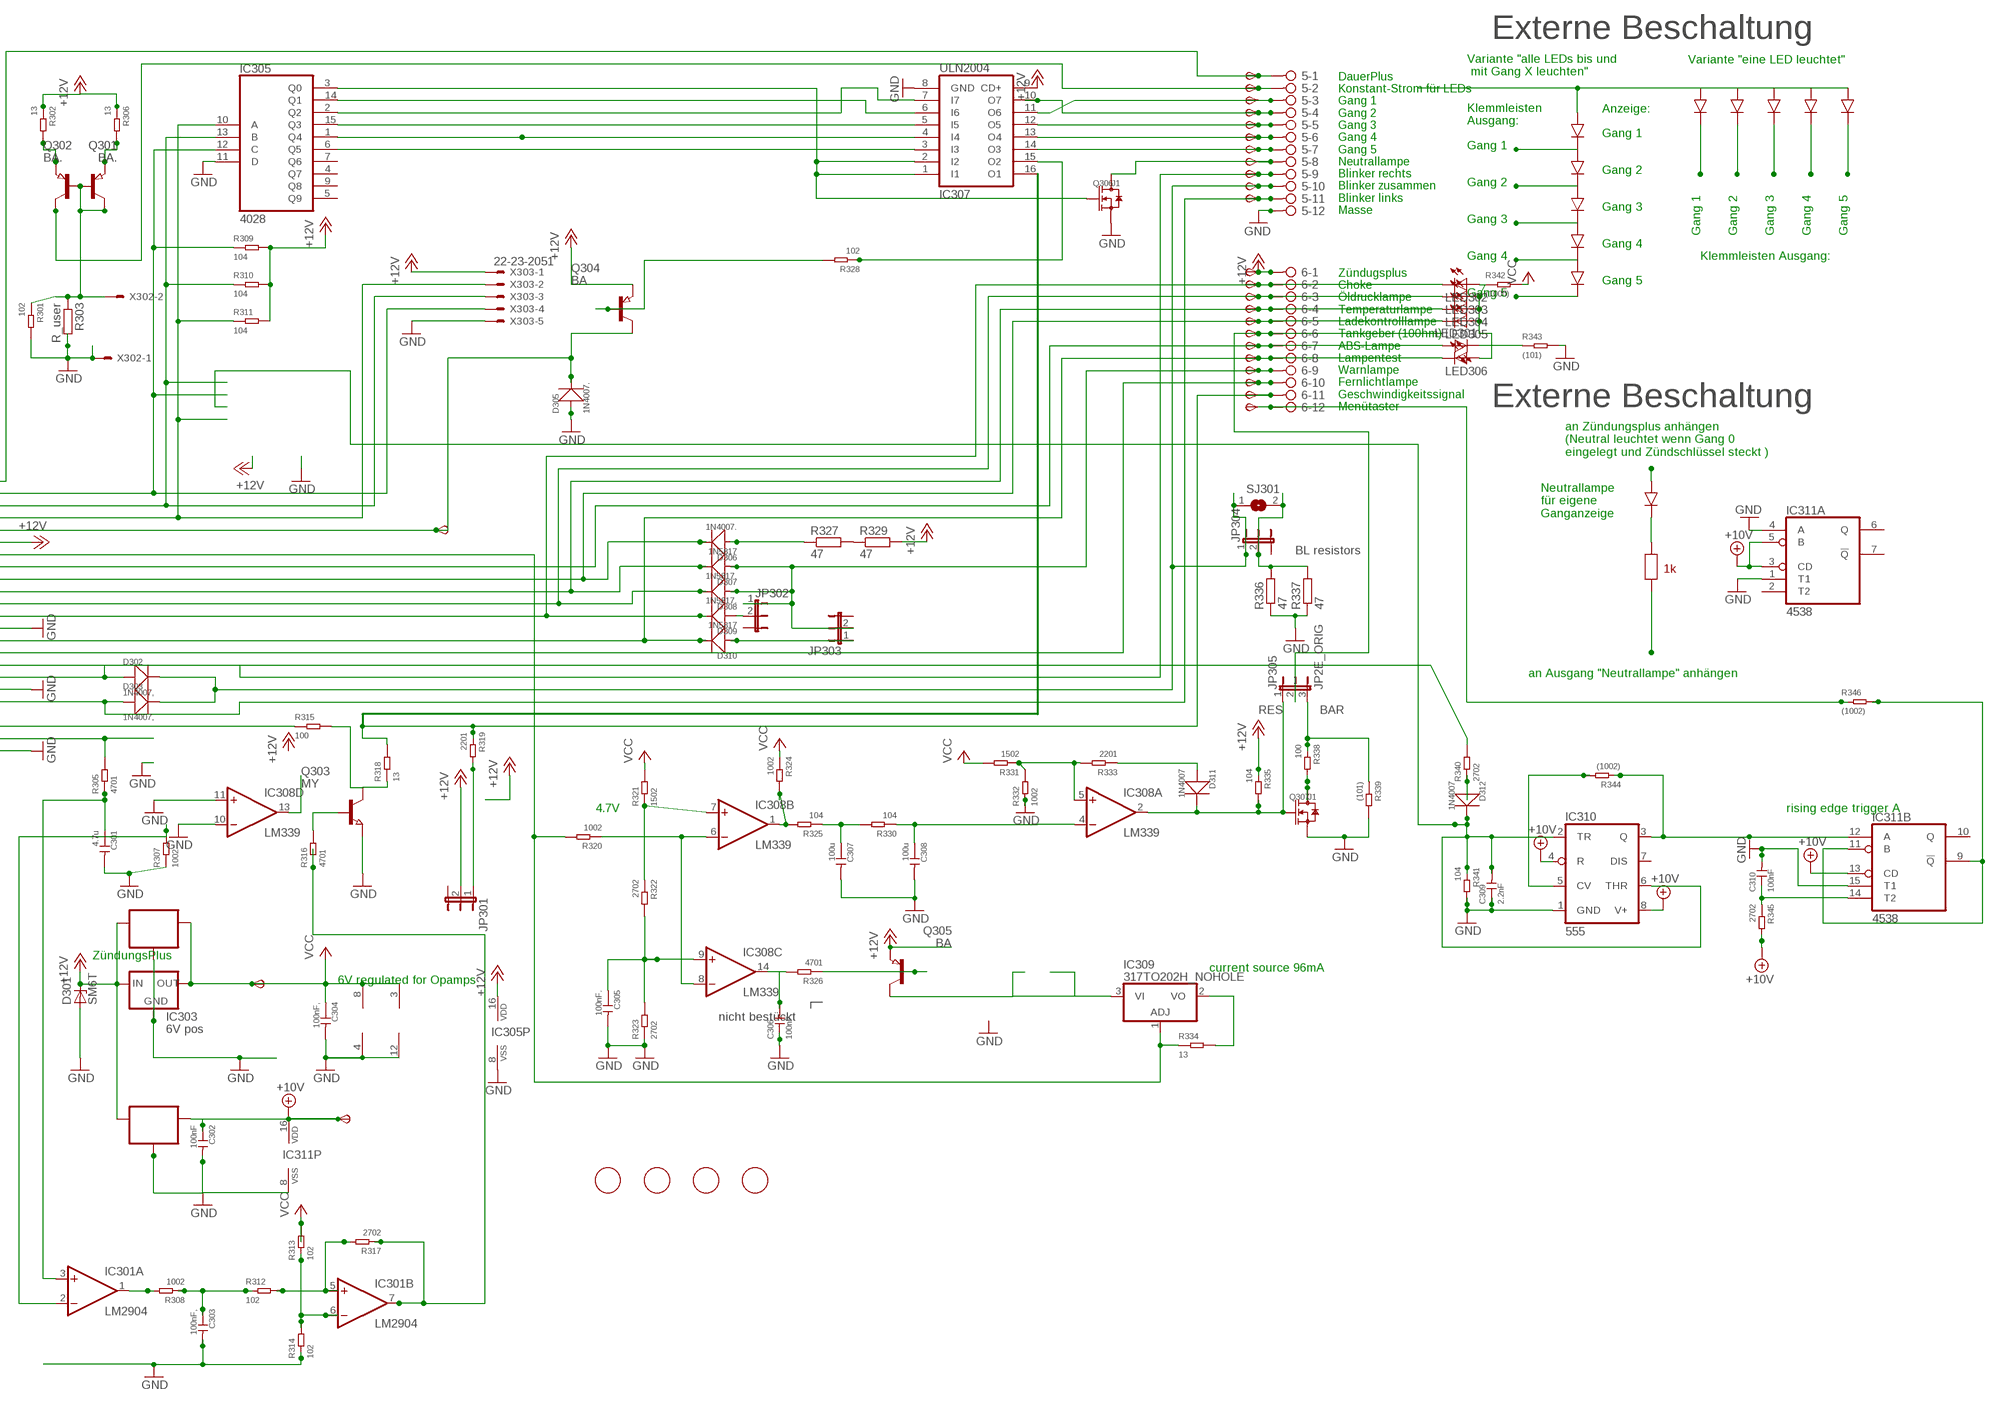
[diagram p5: schematic, sheet 3, part 2 of 2]

### Parts
5  2081-1132  [12-PIN]
6  2081-1132  [12-PIN]
6V301  TPSB2.0  [B2.0]
10V301  TPSB2.0  [B2.0]
C301  4.7u  CERAMIC-4.7UF-25V-10%-X5R(0805)  [C0805]
C302  100nF  CERAMIC-100NF-50V-10%-X7R(0805)  [C0805]
C303  100nF,  CERAMIC-100NF-50V-10%-X7R(0805)  [C0805]
C304  100nF,  CERAMIC-100NF-50V-10%-X7R(0805)  [C0805]
C305  100nF.  CERAMIC-100NF-50V-10%-X7R(0805)  [C0805]
C306  100nF.  CERAMIC-100NF-50V-10%-X7R(0805)  [C0805]
C307  100u  CERAMIC-100UF-6.3V-20%-X5R(1206)  [C1206]
C308  100u  CERAMIC-100UF-6.3V-20%-X5R(1206)  [C1206]
C309  2.2nF  CERAMIC-100NF-50V-10%-X7R(0805)  [C0805]
C310  100nF  CERAMIC-100NF-50V-10%-X7R(0805)  [C0805]
D301  SM6T  [DO214AA]
D302  1N4007,  DIODE-GEN-PURPOSE-1KV-1A(DO-214AC)  [DO-214AC]
D303  1N4007,  DIODE-GEN-PURPOSE-1KV-1A(DO-214AC)  [DO-214AC]
D305  1N4007.  DIODE-GEN-PURPOSE-1KV-1A(DO-214AC)  [DO-214AC]
D306  1N4007.  DIODE-GEN-PURPOSE-1KV-1A(DO-214AC)  [DO-214AC]
D307  1N5817  DIODE-GEN-PURPOSE-1KV-1A(DO-214AC)DO-214AC/1206  [DO-214AC_SLIM]
D308  1N5817.  DIODE-GEN-PURPOSE-1KV-1A(DO-214AC)DO-214AC/1206  [DO-214AC_SLIM]
D309  1N5817.  DIODE-GEN-PURPOSE-1KV-1A(DO-214AC)DO-214AC/1206  [DO-214AC_SLIM]
D310  1N5817  DIODE-GEN-PURPOSE-1KV-1A(DO-214AC)DO-214AC/1206  [DO-214AC_SLIM]
D311  1N4007  DIODE-GEN-PURPOSE-1KV-1A(DO-214AC)  [DO-214AC]
D312  1N4007  DIODE-GEN-PURPOSE-1KV-1A(DO-214AC)  [DO-214AC]
FID301  FIDUCIAL  [FIDUCIAL_1MM]
FID302  FIDUCIAL  [FIDUCIAL_1MM]
FID303  FIDUCIAL  [FIDUCIAL_1MM]
FID304  FIDUCIAL  [FIDUCIAL_1MM]
IC301  LM2904  LM358D  [SO08]
IC302  78L06  78LXXSOT89_ROUND  [SOT89_ROUND]
IC303  6V pos  78LXX  [78LXX]
IC304  78L10  78LXXSOT89_ROUND  [SOT89_ROUND]
IC305  4028  4028D  [SO16]
IC307  ULN2004  ULN2004AD  [SO16]
IC308  LM339  LM339D  [SO14]
IC309  317TO202H_NOHOLE  [TO220H_NOHOLE]
IC310  555  NE555D  [SO08]
IC311  4538  4538D  [SO16]
JP301  JP2EJP2_SMALLPADS  [JP2_SMALLPADS]
JP302  JP2EJP2_SMALLPADS  [JP2_SMALLPADS]
JP303  JP2EJP2_SMALLPADS  [JP2_SMALLPADS]
JP304  JP2EJP2_SMALLPADS  [JP2_SMALLPADS]
JP305  JP2E_ORIG  [JP2_ORIG_SMALLPADS]
LED301  LEDLD260  [LD260]
LED302  LEDLD260  [LD260]
LED303  LEDLD260  [LD260]
LED304  LEDLD260  [LD260]
LED305  LEDLD260  [LD260]
LED306  LEDLD260  [LD260]
Q301  BA.  PNP-TRANSISTOR_SOT89  [SOT89]
Q302  BA.  PNP-TRANSISTOR_SOT89  [SOT89]
Q303  MY  NPN-TRANSISTOR_SOT89  [SOT89]
Q304  BA  PNP-TRANSISTOR_SOT89  [SOT89]
Q305  BA  PNP-TRANSISTOR_SOT89  [SOT89]
Q306  J1  SMD-MOSFET-N-CH-50V-200MA-BSS138W-7-F(SOT-23)  [SOT-23]
Q307  J1  SMD-MOSFET-N-CH-50V-200MA-BSS138W-7-F(SOT-23)  [SOT-23]
R301  102  SMD-RES-1K-5%-1/8W(0805)  [R0805]
R302  13  SMD-RES-13R-5%-1/4W(1206)  [R1206]
R303  R_user  R-EU_R0805  [R0805]
R305  4701  SMD-RES-4.7K-5%-1/8W(0805)  [R0805]
R306  13  SMD-RES-13R-5%-1/4W(1206)  [R1206]
R307  1002  SMD-RES-10K-1%-1/8W(0805)  [R0805]
R308  1002  SMD-RES-10K-1%-1/8W(0805)  [R0805]
R309  104  SMD-RES-10K-1%-1/8W(0805)  [R0805]
R310  104  SMD-RES-10K-1%-1/8W(0805)  [R0805]
R311  104  SMD-RES-10K-1%-1/8W(0805)  [R0805]
R312  102  SMD-RES-1K-5%-1/8W(0805)  [R0805]
R313  102  SMD-RES-1K-5%-1/8W(0805)  [R0805]
R314  102  SMD-RES-1K-5%-1/8W(0805)  [R0805]
R315  100  SMD-RES-220R-5%-1/8W(0805)  [R0805]
R316  4701  SMD-RES-4.7K-5%-1/8W(0805)  [R0805]
R317  2702  SMD-RES-4.7K-5%-1/8W(0805)  [R0805]
R318  13  SMD-RES-13R-5%-1/4W(1206)  [R1206]
R319  2201  SMD-RES-2.2K-5%-1/8W(0805)  [R0805]
R320  1002  SMD-RES-10K-1%-1/8W(0805)  [R0805]
R321  1502  SMD-RES-10K-1%-1/8W(0805)  [R0805]
R322  2702  SMD-RES-4.7K-5%-1/8W(0805)  [R0805]
R323  2702  SMD-RES-4.7K-5%-1/8W(0805)  [R0805]
R324  1002  SMD-RES-10K-1%-1/8W(0805)  [R0805]
R325  104  SMD-RES-10K-1%-1/8W(0805)  [R0805]
R326  4701  SMD-RES-4.7K-5%-1/8W(0805)  [R0805]
R327  47  R-EU_V235/17_1MM  [V235/17_1MM]
R328  102  SMD-RES-1K-5%-1/8W(0805)  [R0805]
R329  47  R-EU_V235/17_1MM  [V235/17_1MM]
R330  104  SMD-RES-10K-1%-1/8W(0805)  [R0805]
R331  1502  SMD-RES-10K-1%-1/8W(0805)  [R0805]
R332  1002  SMD-RES-10K-1%-1/8W(0805)  [R0805]
R333  2201  SMD-RES-2.2K-5%-1/8W(0805)  [R0805]
R334  13  SMD-RES-13R-5%-1/4W(1206)  [R1206]
R335  104  SMD-RES-10K-1%-1/8W(0805)  [R0805]
R336  47  R-EU_V235/17_1MM  [V235/17_1MM]
R337  47  R-EU_V235/17_1MM  [V235/17_1MM]
R338  100  SMD-RES-2.2K-5%-1/8W(0805)  [R0805]
R339  (101)  SMD-RES-2.2K-5%-1/8W(0805)  [R0805]
R340  2702  SMD-RES-10K-1%-1/8W(0805)  [R0805]
R341  104  SMD-RES-10K-1%-1/8W(0805)  [R0805]
R342  (1000)  SMD-RES-100R-5%-1/8W(0805)  [R0805]
R343  (101)  SMD-RES-100R-5%-1/8W(0805)  [R0805]
R344  (1002)  SMD-RES-10K-1%-1/8W(0805)  [R0805]
R345  2702  SMD-RES-4.7K-5%-1/8W(0805)  [R0805]
R346  (1002)  SMD-RES-4.7K-5%-1/8W(0805)  [R0805]
SJ301  SJ  [SJ]
START301  TPSB2.0  [B2.0]
TP47  TPSB2.0  [B2.0]
TP48  TPSB2.0  [B2.0]
TP49  TPSB2.0  [B2.0]
TP50  TPSB2.0  [B2.0]
TP51  TPSB2.0  [B2.0]
TP52  TPSB2.0  [B2.0]
TP53  TPSB2.0  [B2.0]
TP54  TPSB2.0  [B2.0]
TP55  TPSB2.0  [B2.0]
TP56  TPSB2.0  [B2.0]
TP57  TPSB2.0  [B2.0]
TP58  TPSB2.0  [B2.0]
TP59  TPSB2.0  [B2.0]
TP60  TPSB2.0  [B2.0]
TP61  TPSB2.0  [B2.0]
TP62  TPSB2.0  [B2.0]
TP63  TPSB2.0  [B2.0]
TP64  TPSB2.0  [B2.0]
TP65  TPSB1,27  [B1,27]
TP66  TPSB2.0  [B2.0]
TP67  TPSB2.0  [B2.0]
TP68  TPSB2.0  [B2.0]
TP69  TPSB2.0  [B2.0]
X301  CON_BMWV2  [24-PIN_V2]
X302  22-23-2021  [22-23-2021]
X303  22-23-2051  [22-23-2051]

### Nets
+10V: 10V301.TP(PP) C302.1 IC304.1(OUT) IC310.4(R) IC310.8(V+) IC311.3(A:CD) IC311.5(A:B) IC311.13(B:CD) IC311.16(P:VDD) R345.2 ; also sheet 1,2,4,5,6,7,8,9,10,11,12
+12V: 6.1 D301.C IC302.3(IN) IC303.IN IC304.3(IN) IC305.16(VDD) IC307.9(CD+) JP301.2 Q304.3(E) Q305.3(E) R302.1 R306.1 R309.2 R310.2 R311.2 R329.2 R335.1 TP68.TP(PP) X301.6 X303.1 ; also sheet 1,2,4,5,6,7,8,9,10,11,12
+12V3: IC301.7(B:OUT) R316.1 R317.1
GND: 5.12 C301.2 C302.2 C303.2 C304.2 C305.2 C306.1 C307.2 C308.2 C309.1 C310.2 D301.A D305.1(+) IC301.4(P:V-) IC302.2(GND) IC302.2@1(GND) IC303.GND IC304.2(GND) IC304.2@1(GND) IC305.8(VSS) IC305.11(D) IC307.8(GND) IC308.10(D:-IN) IC308.11(D:+IN) IC308.12(P:GND) IC310.1(GND) IC311.1(A:T1) IC311.4(A:A) IC311.8(P:VSS) IC311.15(B:T1) Q303.3(E) Q306.2(S) Q307.2(S) R301.2 R303.2 R307.1 R314.1 R323.1 R332.1 R336.1 R337.1 R339.2 R341.2 R343.2 X301.13 X301.18 X301.23 X302.1 X303.5 ; also sheet 1,2,4,5,6,7,8,9,10,11,12
N$198: R327.2 R329.1
N$199: 6.9 D307.1(+) D308.1(+) JP302.1 JP303.2 TP65.TP(PP)
N$200: IC305.10(A) R311.1 X301.4 X303.2
N$201: IC305.13(B) R310.1 X301.3 X303.3
N$202: D305.2(-) Q304.2(C) START301.TP(PP) X301.5
N$203: IC305.12(C) R309.1 X301.2 X303.4
N$204: 6.7 LED301.A TP63.TP(PP) X301.8
N$205: 6.2 D309.2(-) LED302.K(C) TP58.TP(PP) X301.12
N$206: 6.3 D308.2(-) LED303.K(C) TP59.TP(PP) X301.11
N$207: 6.4 D307.2(-) LED304.K(C) TP60.TP(PP) X301.10
N$208: 6.8 D310.2(-) LED306.K(C) TP64.TP(PP) X301.14
N$209: 5.9 D302.1(+) TP55.TP(PP) X301.17
N$210: 5.11 D303.1(+) TP57.TP(PP) X301.19
N$211: R305.2 X301.22
N$212: C301.1 IC301.3(A:+IN) R305.1
N$213: 6.11 IC307.16(O1) R318.2 R319.1 TP67.TP(PP)
N$214: IC308.1(B:OUT) R324.2 R325.2
N$215: C307.1 R325.1 R330.2
N$216: C308.1 IC308.4(A:-IN) R330.1
N$217: IC308.5(A:+IN) R331.1 R332.2 R333.2
N$218: D311.1(+) R333.1
N$219: C305.1 IC308.9(C:+IN) R322.2 R323.2
N$220: C306.2 IC308.14(C:OUT) R326.2
N$221: Q305.1(B) R326.1
N$222: IC305.2(Q2) IC307.7(I7)
N$223: 5.5 IC307.12(O5) TP51.TP(PP)
N$224: IC305.1(Q4) IC307.4(I4)
N$225: 5.8 Q306.3(D) TP54.TP(PP)
N$226: 6.10 TP66.TP(PP) X301.15
N$227: 6.5 D306.2(-) LED305.K(C) TP61.TP(PP) X301.9
N$228: D306.1(+) R327.1
N$229: IC305.6(Q5) IC307.3(I3)
N$230: 5.4 IC307.10(O7) TP50.TP(PP)
N$231: IC309.1(ADJ) R320.2 R334.1 X301.7
N$232: IC308.6(B:-IN) IC308.8(C:-IN) R320.1
N$233: 5.2 Q301.2(C) TP48.TP(PP)
N$234: 5.1 TP47.TP(PP) X301.1
N$248: R340.2 X301.16
N$249: IC305.15(Q3) IC307.5(I5)
N$250: 5.6 IC307.13(O4) TP52.TP(PP)
N$251: 5.7 IC307.14(O3) TP53.TP(PP)
N$252: 6.6 JP305.2 TP62.TP(PP)
N$253: LED301.K(C) R343.1
N$254: LED302.A LED303.A LED304.A LED305.A LED306.A R342.1
N$255: Q304.1(B) R328.2
N$256: IC305.3(Q0) IC307.1(I1) IC307.2(I2) Q306.1(G)
N$257: IC305.14(Q1) IC307.6(I6)
N$258: 5.3 IC307.11(O6) TP49.TP(PP)
N$259: Q301.1(B) Q302.1(B) Q302.2(C) R301.1 R303.1 X302.2
N$260: Q301.3(E) R302.2
N$261: Q302.3(E) R306.2
N$262: IC308.7(B:+IN) R321.1 R322.1
N$263: IC301.2(A:-IN) R307.2
N$264: Q303.1(B) R316.2
N$265: Q307.3(D) R338.2
N$266: IC309.2(VO) R334.2
N$267: IC309.3(VI) Q305.2(C)
N$268: C309.2 D312.2(-) IC310.2(TR) IC310.6(THR) R341.1
N$269: IC310.5(CV) R344.2
N$270: IC310.3(Q) IC311.12(B:A) R344.1
N$271: D312.1(+) R340.1
N$272: 5.10 D302.2(-) D303.2(-) JP304.1 SJ301.1 TP56.TP(PP)
N$273: JP304.2 R336.2 R337.2 SJ301.2
N$274: IC311.9(B:!Q) IC311.11(B:B) R346.2
N$275: C310.1 IC311.14(B:T2) R345.1
N$276: JP301.1 R319.2
N$277: IC307.15(O2) R328.1
N$278: 6.12 R346.1 TP69.TP(PP)
N$279: D309.1(+) JP302.2
N$280: D311.2(-) IC308.2(A:OUT) JP305.1 Q307.1(G) R335.2
N$281: IC301.1(A:OUT) R308.2
N$282: C303.1 R308.1 R312.1
N$283: IC301.5(B:+IN) R312.2 R317.2
N$284: IC301.6(B:-IN) R313.1 R314.2
N$285: D310.1(+) JP303.1
N$286: JP305.3 R338.1 R339.1
N$287: IC308.13(D:OUT)
N$288: R315.1 X301.21
N$289: Q303.2(C) R315.2 R318.1
VCC: 6V301.TP(PP) C304.1 IC301.8(P:V+) IC302.1(OUT) IC303.OUT IC308.3(P:V+) R313.2 R321.2 R324.1 R331.2 R342.2 ; also sheet 1,2,4,5,6,7,8,9,10,11,12
Unconnected: IC305.4(Q7) IC305.5(Q9) IC305.7(Q6) IC305.9(Q8) IC310.7(DIS) IC311.2(A:T2) IC311.6(A:Q) IC311.7(A:!Q) IC311.10(B:Q) X301.20 X301.24

### Notes on the sheet
- Externe Beschaltung
- Variante "eine LED leuchtet"
- Variante "alle LEDs bis und
   mit Gang X leuchten"
- Anzeige:
- Klemmleisten
  Ausgang:
- Gang 1
- DauerPlus
  Konstant-Strom für LEDs
  Gang 1
  Gang 2
  Gang 3
  Gang 4
  Gang 5
  Neutrallampe
  Blinker rechts
  Blinker zusammen
  Blinker links
  Masse
- Gang 1
- Gang 2
- Gang 2
- Gang 3
- Gang 3
- Gang 1 | Gang 2 | Gang 3 | Gang 4 | Gang 5
- Gang 4
- Gang 4 | Klemmleisten Ausgang:
- Gang 5
- Gang 5
- Zündugsplus
  Choke
  Öldrucklampe
  Temperaturlampe
  Ladekontrolllampe
  Tankgeber (100hm)
  ABS-Lampe
  Lampentest
  Warnlampe
  Fernlichtlampe
  Geschwindigkeitssignal
  Menütaster
- Stromquelle für Gang
  LEDs. Für mehr als 12mA
  muss ein Widerstand "R_user"
  eingelötet werden. Für weniger
  muss der 1kOhm SMD Widerstand
  neben R_user entfernt werden
  I = 12V/1kOhm(default)+12V/R_user
  I= 12mA (default) + 12V/R_user
  Beispiel:
  R_user      Strom in LEDs
  1 kOhm     22-26mA
  ohne       11-13mA
- Externe Beschaltung
- an Zündungsplus anhängen
  (Neutral leuchtet wenn Gang 0
  eingelegt und Zündschlüssel steckt )
- Neutrallampe
  für eigene
  Ganganzeige
- DauerPlus Batterie 12V (rot weiss)
  Ganganzeige Signal C (gelb weiss)
  Ganganzeige Signal B (gelb schwarz)
  Ganganzeige Signal A (gelb dunkelblau)
  12V/350mA zum Starknopf (schwarz grün)
  Zündungsplus 12V (grün schwarz)
  Reservelampe (weiss)
  ABS Leuchte (blau)
  Ladekontrollleuchte (schaltet auf Masse) (violett schwarz)
  Temperaturleuchte (schaltet auf Masse) (braun schwarz)
  Öldruckleuchte (schaltet auf Masse) (braun grün)
  Chokelampe (schaltet auf Masse) (violett weiss)
- BL resistors
- 1k
- an Ausgang "Neutrallampe" anhängen
- Masse (braun)
  Lampentest (schaltet auf Masse)(weiss blau)
  Fernlichtlampe (12V) (weiss)
  Drehzahl Zündspule (schwarz blau)
  Blinker rechts (blau scharz)
  Masse (braun)
  Blinker links (blau rot)
  nicht angeschlossen
  Tachosiganl zum Blinrelais (balu grün)
  Tachogeber (gelb)
  Masse Tachobeger (braun)
  Tachobeleuchtung (12V Zündungsplus) (grau blau)
- RES | BAR
- 4.7V | rising edge trigger A
- ZündungsPlus
- current source 96mA
- 6V regulated for Opamps
- nicht bestückt

## Sheet 4 of 12
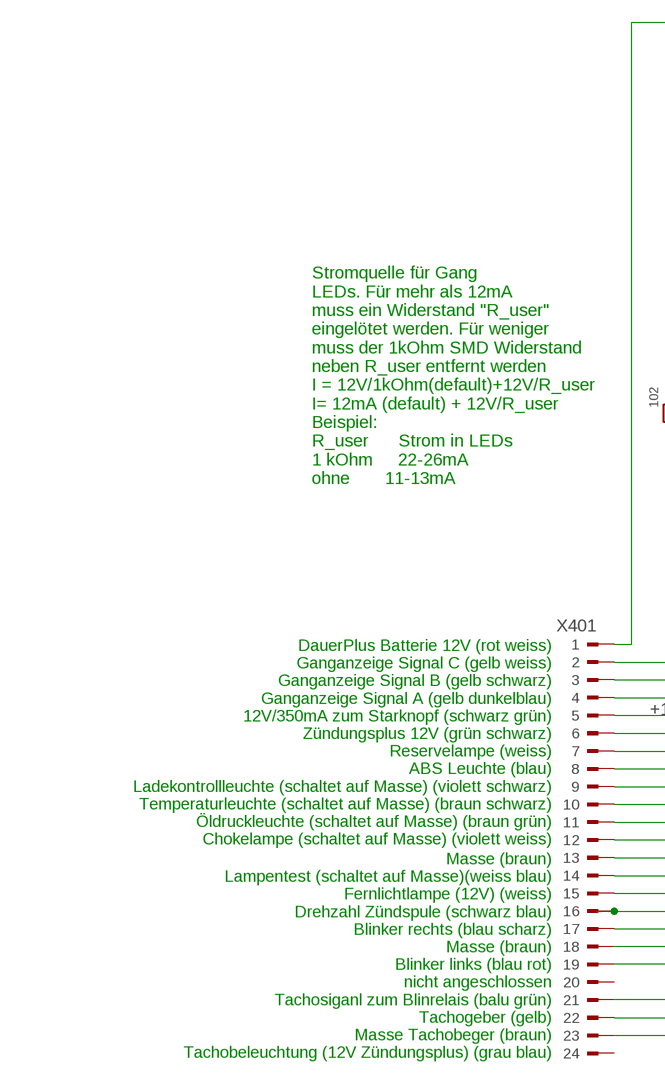
[diagram p6: schematic, sheet 4, part 1 of 2]
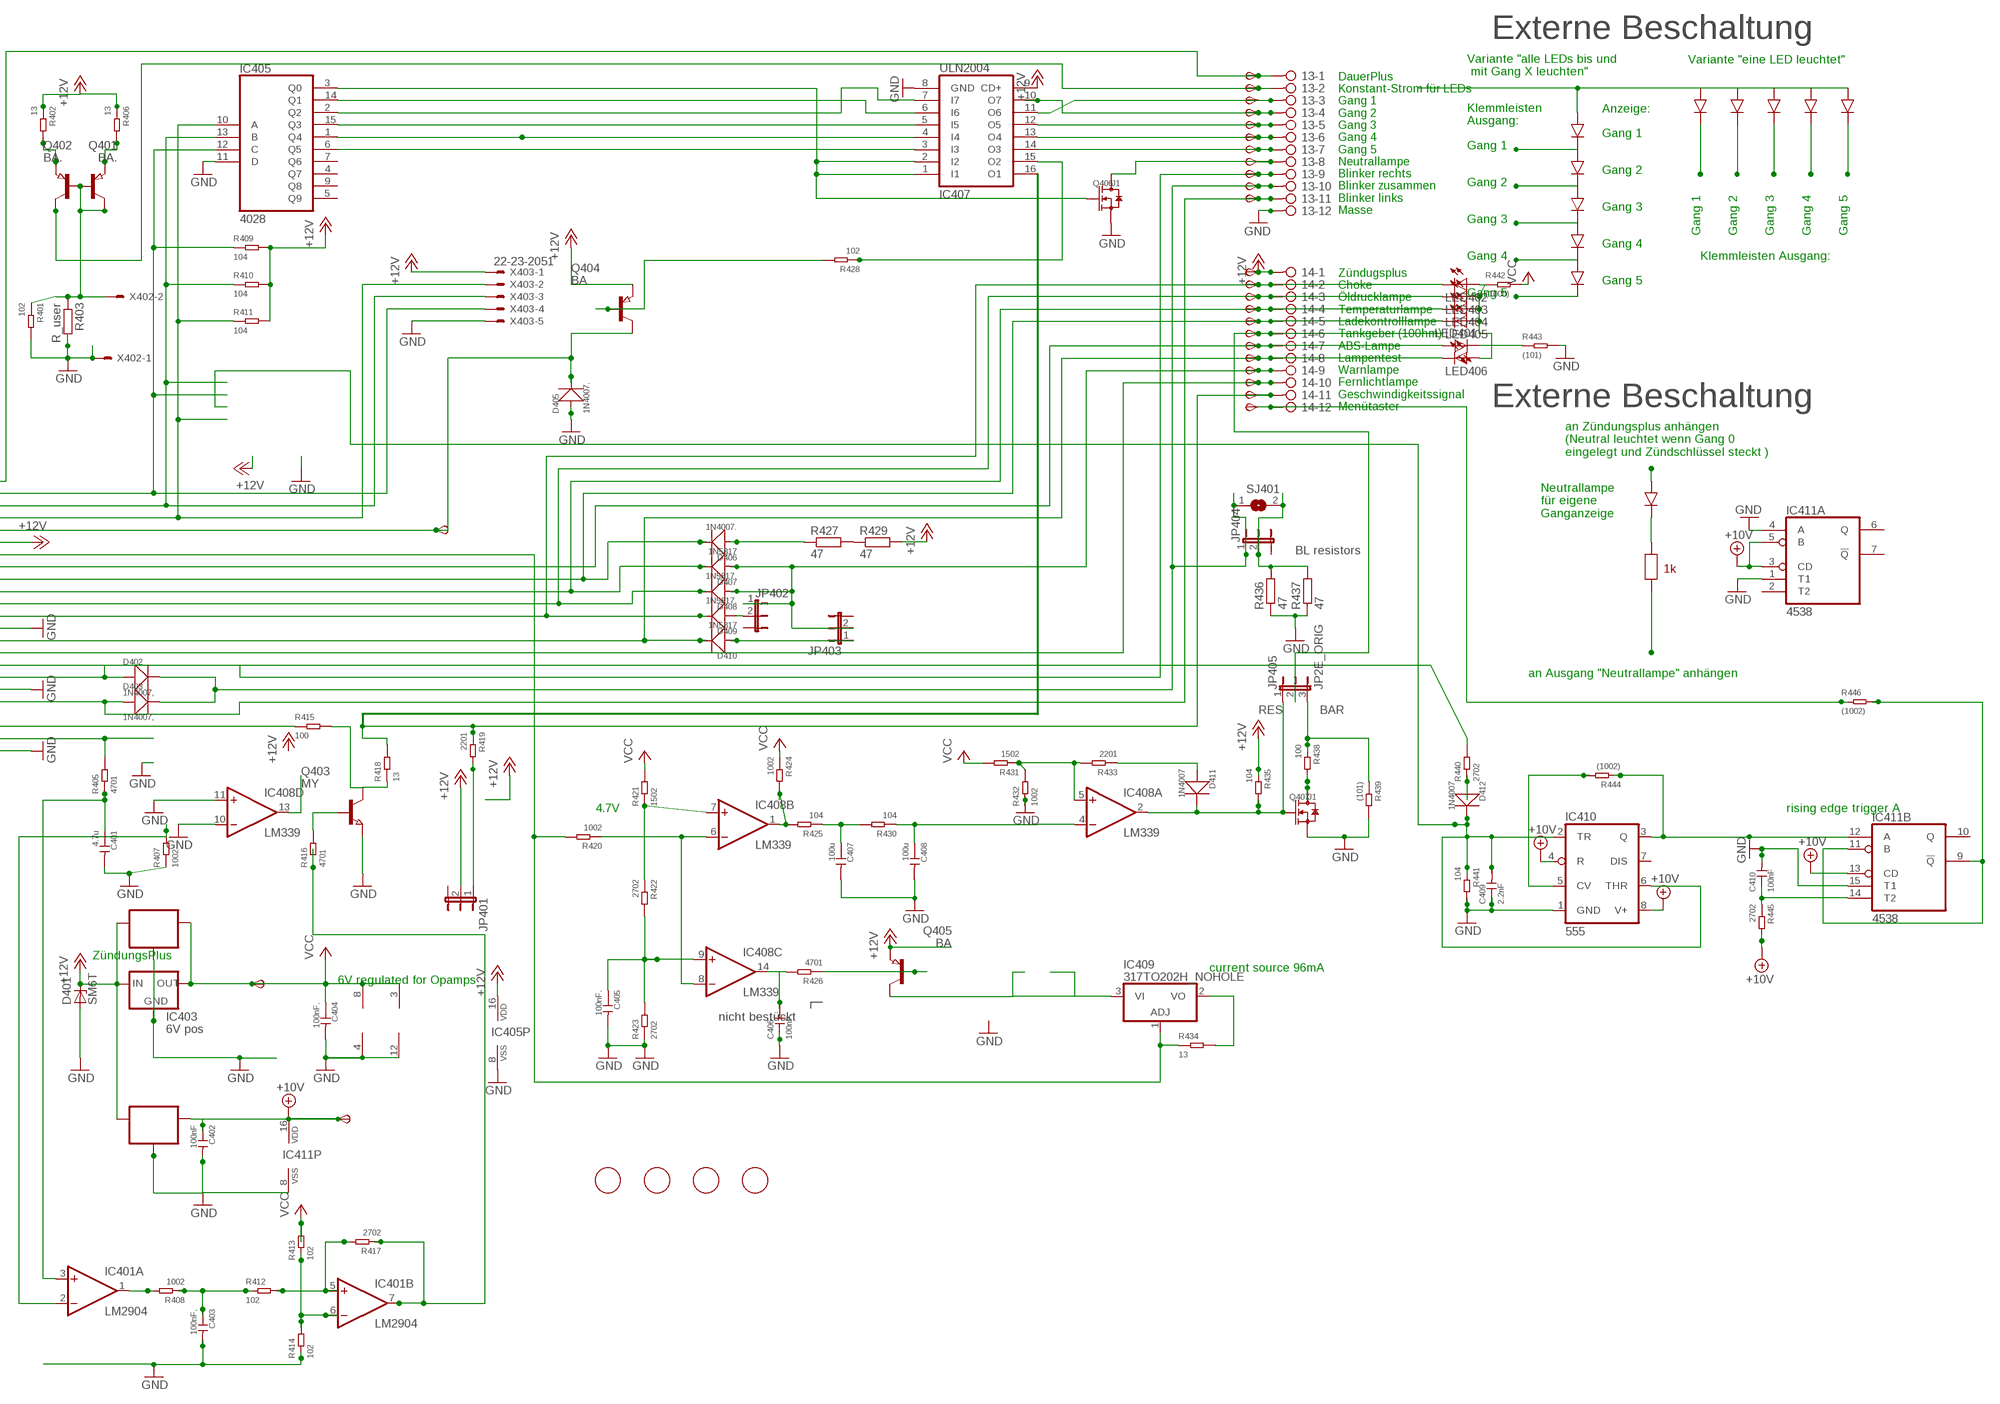
[diagram p7: schematic, sheet 4, part 2 of 2]

### Parts
6V401  TPSB2.0  [B2.0]
10V401  TPSB2.0  [B2.0]
13  2081-1132  [12-PIN]
14  2081-1132  [12-PIN]
C401  4.7u  CERAMIC-4.7UF-25V-10%-X5R(0805)  [C0805]
C402  100nF  CERAMIC-100NF-50V-10%-X7R(0805)  [C0805]
C403  100nF,  CERAMIC-100NF-50V-10%-X7R(0805)  [C0805]
C404  100nF,  CERAMIC-100NF-50V-10%-X7R(0805)  [C0805]
C405  100nF.  CERAMIC-100NF-50V-10%-X7R(0805)  [C0805]
C406  100nF.  CERAMIC-100NF-50V-10%-X7R(0805)  [C0805]
C407  100u  CERAMIC-100UF-6.3V-20%-X5R(1206)  [C1206]
C408  100u  CERAMIC-100UF-6.3V-20%-X5R(1206)  [C1206]
C409  2.2nF  CERAMIC-100NF-50V-10%-X7R(0805)  [C0805]
C410  100nF  CERAMIC-100NF-50V-10%-X7R(0805)  [C0805]
D401  SM6T  [DO214AA]
D402  1N4007,  DIODE-GEN-PURPOSE-1KV-1A(DO-214AC)  [DO-214AC]
D403  1N4007,  DIODE-GEN-PURPOSE-1KV-1A(DO-214AC)  [DO-214AC]
D405  1N4007.  DIODE-GEN-PURPOSE-1KV-1A(DO-214AC)  [DO-214AC]
D406  1N4007.  DIODE-GEN-PURPOSE-1KV-1A(DO-214AC)  [DO-214AC]
D407  1N5817  DIODE-GEN-PURPOSE-1KV-1A(DO-214AC)DO-214AC/1206  [DO-214AC_SLIM]
D408  1N5817.  DIODE-GEN-PURPOSE-1KV-1A(DO-214AC)DO-214AC/1206  [DO-214AC_SLIM]
D409  1N5817.  DIODE-GEN-PURPOSE-1KV-1A(DO-214AC)DO-214AC/1206  [DO-214AC_SLIM]
D410  1N5817  DIODE-GEN-PURPOSE-1KV-1A(DO-214AC)DO-214AC/1206  [DO-214AC_SLIM]
D411  1N4007  DIODE-GEN-PURPOSE-1KV-1A(DO-214AC)  [DO-214AC]
D412  1N4007  DIODE-GEN-PURPOSE-1KV-1A(DO-214AC)  [DO-214AC]
FID401  FIDUCIAL  [FIDUCIAL_1MM]
FID402  FIDUCIAL  [FIDUCIAL_1MM]
FID403  FIDUCIAL  [FIDUCIAL_1MM]
FID404  FIDUCIAL  [FIDUCIAL_1MM]
IC401  LM2904  LM358D  [SO08]
IC402  78L06  78LXXSOT89_ROUND  [SOT89_ROUND]
IC403  6V pos  78LXX  [78LXX]
IC404  78L10  78LXXSOT89_ROUND  [SOT89_ROUND]
IC405  4028  4028D  [SO16]
IC407  ULN2004  ULN2004AD  [SO16]
IC408  LM339  LM339D  [SO14]
IC409  317TO202H_NOHOLE  [TO220H_NOHOLE]
IC410  555  NE555D  [SO08]
IC411  4538  4538D  [SO16]
JP401  JP2EJP2_SMALLPADS  [JP2_SMALLPADS]
JP402  JP2EJP2_SMALLPADS  [JP2_SMALLPADS]
JP403  JP2EJP2_SMALLPADS  [JP2_SMALLPADS]
JP404  JP2EJP2_SMALLPADS  [JP2_SMALLPADS]
JP405  JP2E_ORIG  [JP2_ORIG_SMALLPADS]
LED401  LEDLD260  [LD260]
LED402  LEDLD260  [LD260]
LED403  LEDLD260  [LD260]
LED404  LEDLD260  [LD260]
LED405  LEDLD260  [LD260]
LED406  LEDLD260  [LD260]
Q401  BA.  PNP-TRANSISTOR_SOT89  [SOT89]
Q402  BA.  PNP-TRANSISTOR_SOT89  [SOT89]
Q403  MY  NPN-TRANSISTOR_SOT89  [SOT89]
Q404  BA  PNP-TRANSISTOR_SOT89  [SOT89]
Q405  BA  PNP-TRANSISTOR_SOT89  [SOT89]
Q406  J1  SMD-MOSFET-N-CH-50V-200MA-BSS138W-7-F(SOT-23)  [SOT-23]
Q407  J1  SMD-MOSFET-N-CH-50V-200MA-BSS138W-7-F(SOT-23)  [SOT-23]
R401  102  SMD-RES-1K-5%-1/8W(0805)  [R0805]
R402  13  SMD-RES-13R-5%-1/4W(1206)  [R1206]
R403  R_user  R-EU_R0805  [R0805]
R405  4701  SMD-RES-4.7K-5%-1/8W(0805)  [R0805]
R406  13  SMD-RES-13R-5%-1/4W(1206)  [R1206]
R407  1002  SMD-RES-10K-1%-1/8W(0805)  [R0805]
R408  1002  SMD-RES-10K-1%-1/8W(0805)  [R0805]
R409  104  SMD-RES-10K-1%-1/8W(0805)  [R0805]
R410  104  SMD-RES-10K-1%-1/8W(0805)  [R0805]
R411  104  SMD-RES-10K-1%-1/8W(0805)  [R0805]
R412  102  SMD-RES-1K-5%-1/8W(0805)  [R0805]
R413  102  SMD-RES-1K-5%-1/8W(0805)  [R0805]
R414  102  SMD-RES-1K-5%-1/8W(0805)  [R0805]
R415  100  SMD-RES-220R-5%-1/8W(0805)  [R0805]
R416  4701  SMD-RES-4.7K-5%-1/8W(0805)  [R0805]
R417  2702  SMD-RES-4.7K-5%-1/8W(0805)  [R0805]
R418  13  SMD-RES-13R-5%-1/4W(1206)  [R1206]
R419  2201  SMD-RES-2.2K-5%-1/8W(0805)  [R0805]
R420  1002  SMD-RES-10K-1%-1/8W(0805)  [R0805]
R421  1502  SMD-RES-10K-1%-1/8W(0805)  [R0805]
R422  2702  SMD-RES-4.7K-5%-1/8W(0805)  [R0805]
R423  2702  SMD-RES-4.7K-5%-1/8W(0805)  [R0805]
R424  1002  SMD-RES-10K-1%-1/8W(0805)  [R0805]
R425  104  SMD-RES-10K-1%-1/8W(0805)  [R0805]
R426  4701  SMD-RES-4.7K-5%-1/8W(0805)  [R0805]
R427  47  R-EU_V235/17_1MM  [V235/17_1MM]
R428  102  SMD-RES-1K-5%-1/8W(0805)  [R0805]
R429  47  R-EU_V235/17_1MM  [V235/17_1MM]
R430  104  SMD-RES-10K-1%-1/8W(0805)  [R0805]
R431  1502  SMD-RES-10K-1%-1/8W(0805)  [R0805]
R432  1002  SMD-RES-10K-1%-1/8W(0805)  [R0805]
R433  2201  SMD-RES-2.2K-5%-1/8W(0805)  [R0805]
R434  13  SMD-RES-13R-5%-1/4W(1206)  [R1206]
R435  104  SMD-RES-10K-1%-1/8W(0805)  [R0805]
R436  47  R-EU_V235/17_1MM  [V235/17_1MM]
R437  47  R-EU_V235/17_1MM  [V235/17_1MM]
R438  100  SMD-RES-2.2K-5%-1/8W(0805)  [R0805]
R439  (101)  SMD-RES-2.2K-5%-1/8W(0805)  [R0805]
R440  2702  SMD-RES-10K-1%-1/8W(0805)  [R0805]
R441  104  SMD-RES-10K-1%-1/8W(0805)  [R0805]
R442  (1000)  SMD-RES-100R-5%-1/8W(0805)  [R0805]
R443  (101)  SMD-RES-100R-5%-1/8W(0805)  [R0805]
R444  (1002)  SMD-RES-10K-1%-1/8W(0805)  [R0805]
R445  2702  SMD-RES-4.7K-5%-1/8W(0805)  [R0805]
R446  (1002)  SMD-RES-4.7K-5%-1/8W(0805)  [R0805]
SJ401  SJ  [SJ]
START401  TPSB2.0  [B2.0]
TP139  TPSB2.0  [B2.0]
TP140  TPSB2.0  [B2.0]
TP141  TPSB2.0  [B2.0]
TP142  TPSB2.0  [B2.0]
TP143  TPSB2.0  [B2.0]
TP144  TPSB2.0  [B2.0]
TP145  TPSB2.0  [B2.0]
TP146  TPSB2.0  [B2.0]
TP147  TPSB2.0  [B2.0]
TP148  TPSB2.0  [B2.0]
TP149  TPSB2.0  [B2.0]
TP150  TPSB2.0  [B2.0]
TP151  TPSB2.0  [B2.0]
TP152  TPSB2.0  [B2.0]
TP153  TPSB2.0  [B2.0]
TP154  TPSB2.0  [B2.0]
TP155  TPSB2.0  [B2.0]
TP156  TPSB2.0  [B2.0]
TP157  TPSB1,27  [B1,27]
TP158  TPSB2.0  [B2.0]
TP159  TPSB2.0  [B2.0]
TP160  TPSB2.0  [B2.0]
TP161  TPSB2.0  [B2.0]
X401  CON_BMWV2  [24-PIN_V2]
X402  22-23-2021  [22-23-2021]
X403  22-23-2051  [22-23-2051]

### Nets
+10V: 10V401.TP(PP) C402.1 IC404.1(OUT) IC410.4(R) IC410.8(V+) IC411.3(A:CD) IC411.5(A:B) IC411.13(B:CD) IC411.16(P:VDD) R445.2 ; also sheet 1,2,3,5,6,7,8,9,10,11,12
+12V: 14.1 D401.C IC402.3(IN) IC403.IN IC404.3(IN) IC405.16(VDD) IC407.9(CD+) JP401.2 Q404.3(E) Q405.3(E) R402.1 R406.1 R409.2 R410.2 R411.2 R429.2 R435.1 TP160.TP(PP) X401.6 X403.1 ; also sheet 1,2,3,5,6,7,8,9,10,11,12
+12V7: IC401.7(B:OUT) R416.1 R417.1
GND: 13.12 C401.2 C402.2 C403.2 C404.2 C405.2 C406.1 C407.2 C408.2 C409.1 C410.2 D401.A D405.1(+) IC401.4(P:V-) IC402.2(GND) IC402.2@1(GND) IC403.GND IC404.2(GND) IC404.2@1(GND) IC405.8(VSS) IC405.11(D) IC407.8(GND) IC408.10(D:-IN) IC408.11(D:+IN) IC408.12(P:GND) IC410.1(GND) IC411.1(A:T1) IC411.4(A:A) IC411.8(P:VSS) IC411.15(B:T1) Q403.3(E) Q406.2(S) Q407.2(S) R401.2 R403.2 R407.1 R414.1 R423.1 R432.1 R436.1 R437.1 R439.2 R441.2 R443.2 X401.13 X401.18 X401.23 X402.1 X403.5 ; also sheet 1,2,3,5,6,7,8,9,10,11,12
N$595: R427.2 R429.1
N$596: 14.9 D407.1(+) D408.1(+) JP402.1 JP403.2 TP157.TP(PP)
N$597: IC405.10(A) R411.1 X401.4 X403.2
N$598: IC405.13(B) R410.1 X401.3 X403.3
N$599: D405.2(-) Q404.2(C) START401.TP(PP) X401.5
N$600: IC405.12(C) R409.1 X401.2 X403.4
N$601: 14.7 LED401.A TP155.TP(PP) X401.8
N$602: 14.2 D409.2(-) LED402.K(C) TP150.TP(PP) X401.12
N$603: 14.3 D408.2(-) LED403.K(C) TP151.TP(PP) X401.11
N$604: 14.4 D407.2(-) LED404.K(C) TP152.TP(PP) X401.10
N$605: 14.8 D410.2(-) LED406.K(C) TP156.TP(PP) X401.14
N$606: 13.9 D402.1(+) TP147.TP(PP) X401.17
N$607: 13.11 D403.1(+) TP149.TP(PP) X401.19
N$608: R405.2 X401.22
N$609: C401.1 IC401.3(A:+IN) R405.1
N$610: 14.11 IC407.16(O1) R418.2 R419.1 TP159.TP(PP)
N$611: IC408.1(B:OUT) R424.2 R425.2
N$612: C407.1 R425.1 R430.2
N$613: C408.1 IC408.4(A:-IN) R430.1
N$614: IC408.5(A:+IN) R431.1 R432.2 R433.2
N$615: D411.1(+) R433.1
N$616: C405.1 IC408.9(C:+IN) R422.2 R423.2
N$617: C406.2 IC408.14(C:OUT) R426.2
N$618: Q405.1(B) R426.1
N$619: IC405.2(Q2) IC407.7(I7)
N$620: 13.5 IC407.12(O5) TP143.TP(PP)
N$621: IC405.1(Q4) IC407.4(I4)
N$622: 13.8 Q406.3(D) TP146.TP(PP)
N$623: 14.10 TP158.TP(PP) X401.15
N$624: 14.5 D406.2(-) LED405.K(C) TP153.TP(PP) X401.9
N$625: D406.1(+) R427.1
N$626: IC405.6(Q5) IC407.3(I3)
N$627: 13.4 IC407.10(O7) TP142.TP(PP)
N$628: IC409.1(ADJ) R420.2 R434.1 X401.7
N$629: IC408.6(B:-IN) IC408.8(C:-IN) R420.1
N$630: 13.2 Q401.2(C) TP140.TP(PP)
N$631: 13.1 TP139.TP(PP) X401.1
N$645: R440.2 X401.16
N$646: IC405.15(Q3) IC407.5(I5)
N$647: 13.6 IC407.13(O4) TP144.TP(PP)
N$648: 13.7 IC407.14(O3) TP145.TP(PP)
N$649: 14.6 JP405.2 TP154.TP(PP)
N$650: LED401.K(C) R443.1
N$651: LED402.A LED403.A LED404.A LED405.A LED406.A R442.1
N$652: Q404.1(B) R428.2
N$653: IC405.3(Q0) IC407.1(I1) IC407.2(I2) Q406.1(G)
N$654: IC405.14(Q1) IC407.6(I6)
N$655: 13.3 IC407.11(O6) TP141.TP(PP)
N$656: Q401.1(B) Q402.1(B) Q402.2(C) R401.1 R403.1 X402.2
N$657: Q401.3(E) R402.2
N$658: Q402.3(E) R406.2
N$659: IC408.7(B:+IN) R421.1 R422.1
N$660: IC401.2(A:-IN) R407.2
N$661: Q403.1(B) R416.2
N$662: Q407.3(D) R438.2
N$663: IC409.2(VO) R434.2
N$664: IC409.3(VI) Q405.2(C)
N$665: C409.2 D412.2(-) IC410.2(TR) IC410.6(THR) R441.1
N$666: IC410.5(CV) R444.2
N$667: IC410.3(Q) IC411.12(B:A) R444.1
N$668: D412.1(+) R440.1
N$669: 13.10 D402.2(-) D403.2(-) JP404.1 SJ401.1 TP148.TP(PP)
N$670: JP404.2 R436.2 R437.2 SJ401.2
N$671: IC411.9(B:!Q) IC411.11(B:B) R446.2
N$672: C410.1 IC411.14(B:T2) R445.1
N$673: JP401.1 R419.2
N$674: IC407.15(O2) R428.1
N$675: 14.12 R446.1 TP161.TP(PP)
N$676: D409.1(+) JP402.2
N$677: D411.2(-) IC408.2(A:OUT) JP405.1 Q407.1(G) R435.2
N$678: IC401.1(A:OUT) R408.2
N$679: C403.1 R408.1 R412.1
N$680: IC401.5(B:+IN) R412.2 R417.2
N$681: IC401.6(B:-IN) R413.1 R414.2
N$682: D410.1(+) JP403.1
N$683: JP405.3 R438.1 R439.1
N$684: IC408.13(D:OUT)
N$685: R415.1 X401.21
N$686: Q403.2(C) R415.2 R418.1
VCC: 6V401.TP(PP) C404.1 IC401.8(P:V+) IC402.1(OUT) IC403.OUT IC408.3(P:V+) R413.2 R421.2 R424.1 R431.2 R442.2 ; also sheet 1,2,3,5,6,7,8,9,10,11,12
Unconnected: IC405.4(Q7) IC405.5(Q9) IC405.7(Q6) IC405.9(Q8) IC410.7(DIS) IC411.2(A:T2) IC411.6(A:Q) IC411.7(A:!Q) IC411.10(B:Q) X401.20 X401.24

### Notes on the sheet
- Externe Beschaltung
- Variante "eine LED leuchtet"
- Variante "alle LEDs bis und
   mit Gang X leuchten"
- Anzeige:
- Klemmleisten
  Ausgang:
- Gang 1
- DauerPlus
  Konstant-Strom für LEDs
  Gang 1
  Gang 2
  Gang 3
  Gang 4
  Gang 5
  Neutrallampe
  Blinker rechts
  Blinker zusammen
  Blinker links
  Masse
- Gang 1
- Gang 2
- Gang 2
- Gang 3
- Gang 3
- Gang 1 | Gang 2 | Gang 3 | Gang 4 | Gang 5
- Gang 4
- Gang 4 | Klemmleisten Ausgang:
- Gang 5
- Gang 5
- Zündugsplus
  Choke
  Öldrucklampe
  Temperaturlampe
  Ladekontrolllampe
  Tankgeber (100hm)
  ABS-Lampe
  Lampentest
  Warnlampe
  Fernlichtlampe
  Geschwindigkeitssignal
  Menütaster
- Stromquelle für Gang
  LEDs. Für mehr als 12mA
  muss ein Widerstand "R_user"
  eingelötet werden. Für weniger
  muss der 1kOhm SMD Widerstand
  neben R_user entfernt werden
  I = 12V/1kOhm(default)+12V/R_user
  I= 12mA (default) + 12V/R_user
  Beispiel:
  R_user      Strom in LEDs
  1 kOhm     22-26mA
  ohne       11-13mA
- Externe Beschaltung
- an Zündungsplus anhängen
  (Neutral leuchtet wenn Gang 0
  eingelegt und Zündschlüssel steckt )
- Neutrallampe
  für eigene
  Ganganzeige
- DauerPlus Batterie 12V (rot weiss)
  Ganganzeige Signal C (gelb weiss)
  Ganganzeige Signal B (gelb schwarz)
  Ganganzeige Signal A (gelb dunkelblau)
  12V/350mA zum Starknopf (schwarz grün)
  Zündungsplus 12V (grün schwarz)
  Reservelampe (weiss)
  ABS Leuchte (blau)
  Ladekontrollleuchte (schaltet auf Masse) (violett schwarz)
  Temperaturleuchte (schaltet auf Masse) (braun schwarz)
  Öldruckleuchte (schaltet auf Masse) (braun grün)
  Chokelampe (schaltet auf Masse) (violett weiss)
- BL resistors
- 1k
- an Ausgang "Neutrallampe" anhängen
- Masse (braun)
  Lampentest (schaltet auf Masse)(weiss blau)
  Fernlichtlampe (12V) (weiss)
  Drehzahl Zündspule (schwarz blau)
  Blinker rechts (blau scharz)
  Masse (braun)
  Blinker links (blau rot)
  nicht angeschlossen
  Tachosiganl zum Blinrelais (balu grün)
  Tachogeber (gelb)
  Masse Tachobeger (braun)
  Tachobeleuchtung (12V Zündungsplus) (grau blau)
- RES | BAR
- 4.7V | rising edge trigger A
- ZündungsPlus
- current source 96mA
- 6V regulated for Opamps
- nicht bestückt